# EAGLE schematic pdp8i-fpga (EAGLE 6.6.0), part 3 of 4
## Sheet 27 of 40
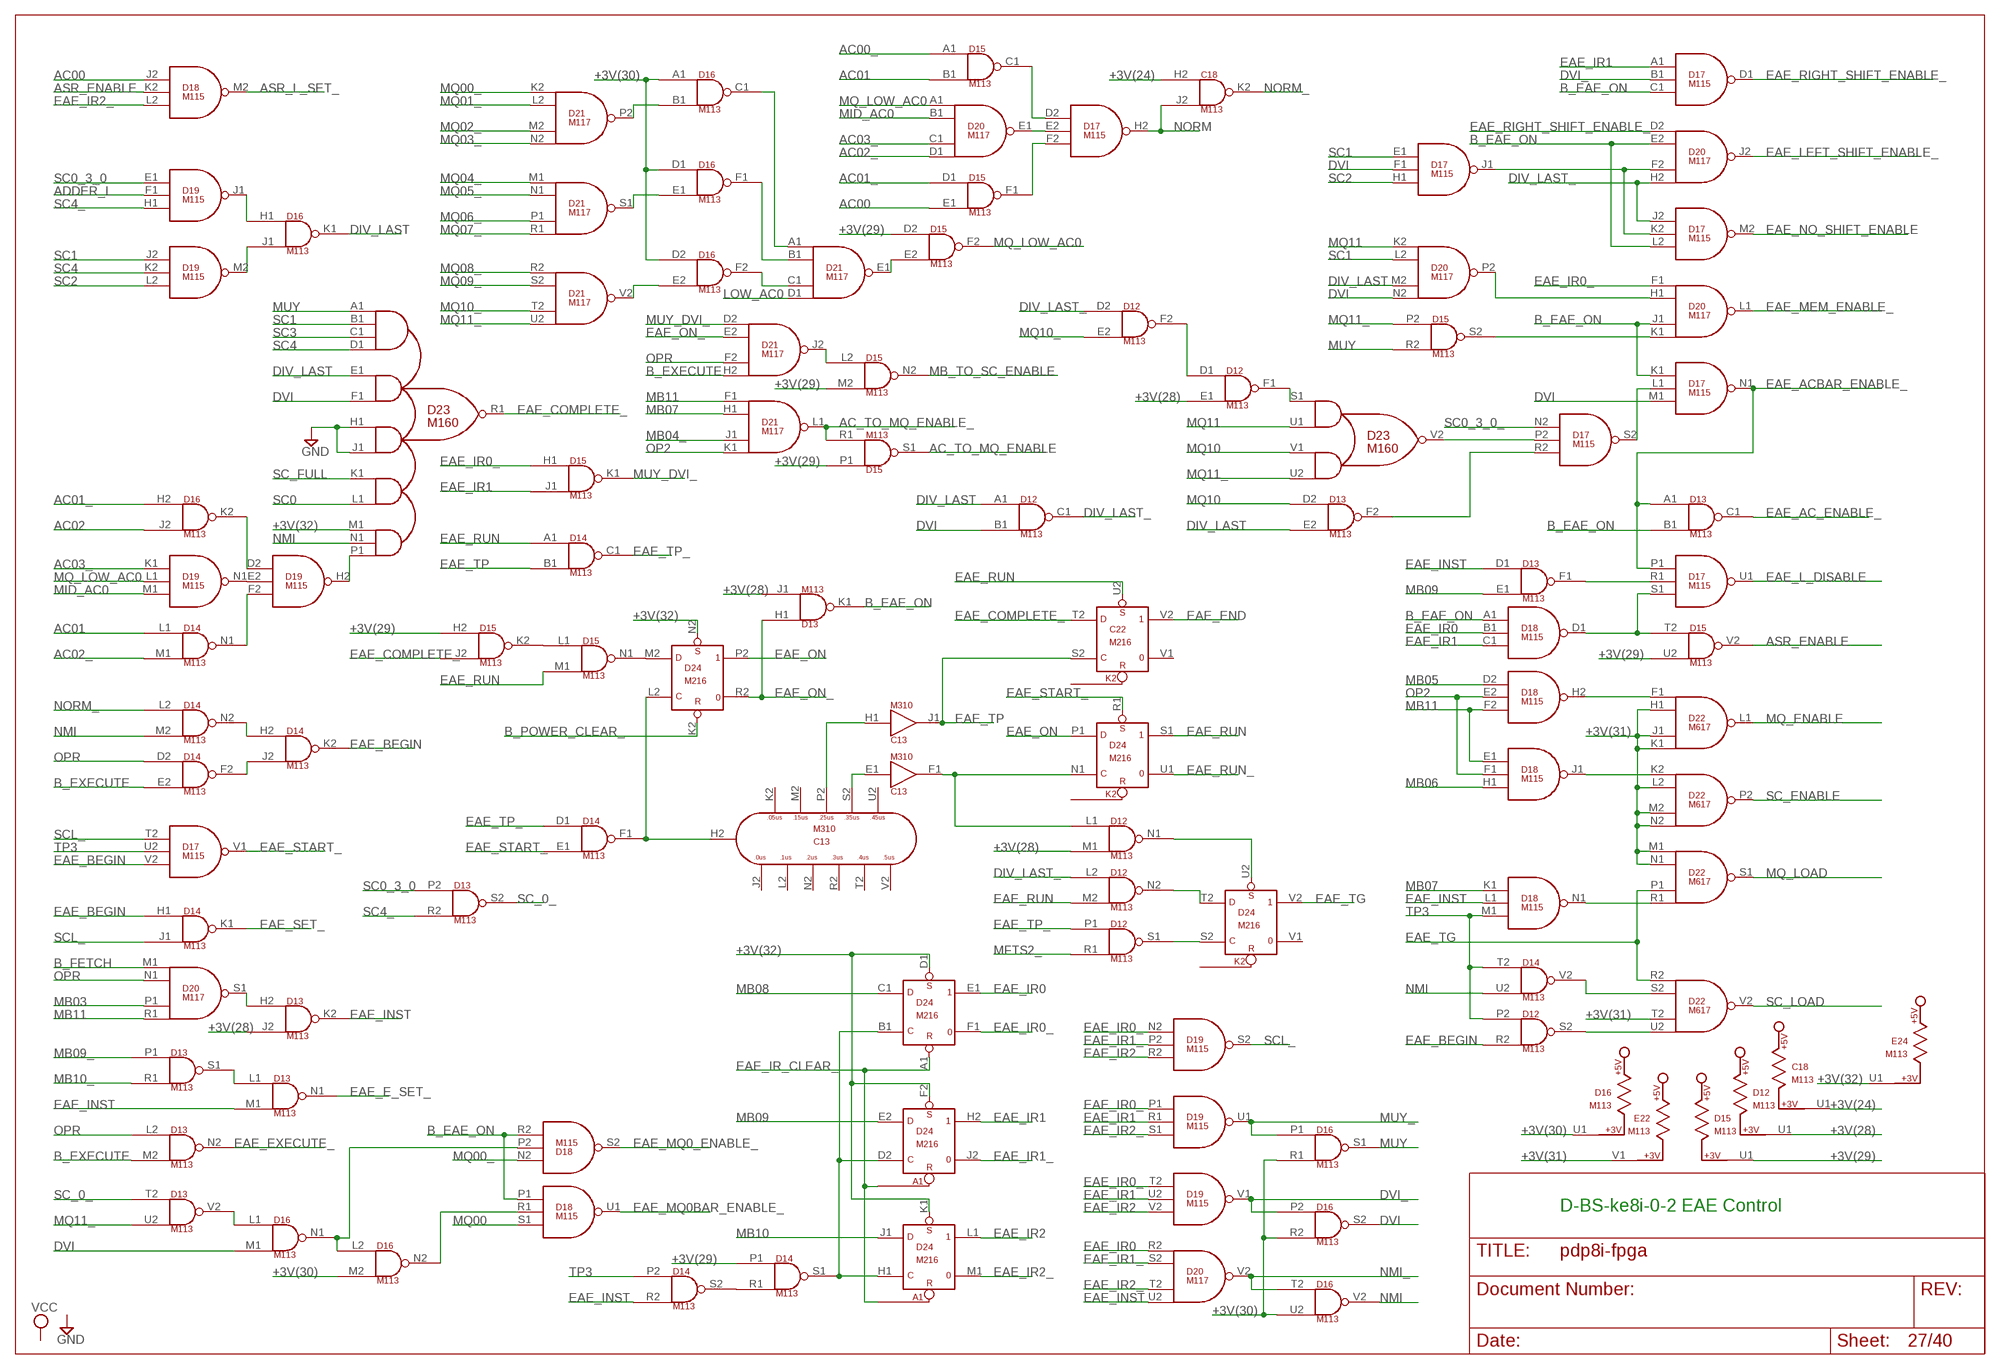
[diagram p27: schematic, sheet 27]

### Parts
C13  M310  [H807]
C18  M113  [H807]
C22  M216  [H807]
D12  M113  [H807]
D13  M113  [H807]
D14  M113  [H807]
D15  M113  [H807]
D16  M113  [H807]
D17  M115  [H807]
D18  M115  [H807]
D19  M115  [H807]
D20  M117  [H807]
D21  M117  [H807]
D22  M617  [H807]
D23  M160  [H807]
D24  M216  [H807]

### Nets
+3V(24): C18.H2(K2:IN1) C18.U1 ; also sheet 28
+3V(28): D12.E1(F1:IN2) D12.M1(N1:IN2) D12.U1 D13.J1(K1:IN2) D13.J2(K2:IN2) ; also sheet 28
+3V(29): D14.P1(S1:IN1) D15.D2(F2:IN1) D15.H2(K2:IN1) D15.M2(N2:IN2) D15.P1(S1:IN1) D15.U1 D15.U2(V2:IN2)
+3V(30): D16.A1(C1:IN1) D16.D1(F1:IN1) D16.D2(F2:IN1) D16.M2(N2:IN2) D16.R1(S1:IN2) D16.R2(S2:IN2) D16.U1 D16.U2(V2:IN2)
+3V(31): D22.H1(L1:IN2) D22.J1(L1:IN3) D22.K1(L1:IN4) D22.L2(P2:IN2) D22.M1(S1:IN1) D22.M2(P2:IN3) D22.N1(S1:IN2) D22.N2(P2:IN4) D22.T2(U2:IN3) E22.V1
+3V(32): D23.M1(R1:IN5A) D24.D1(E1:S) D24.F2(H2:S) D24.K1(L1:S) D24.N2(P2:S) E24.U1 ; also sheet 28
AC00: D15.E1(F1:IN2) D18.J2(M2:IN1) ; also sheet 7,9,14,28,37
AC00_: D15.A1(C1:IN1) ; also sheet 7,9
AC01: D14.L1(N1:IN1) D15.B1(C1:IN2) ; also sheet 9,14,28,37
AC01_: D15.D1(F1:IN1) D16.H2(K2:IN1) ; also sheet 7,9
AC02: D16.J2(K2:IN2) ; also sheet 9,14,28,33,37
AC02_: D14.M1(N1:IN2) D20.D1(E1:IN4) ; also sheet 7,9
AC03_: D19.K1(N1:IN1) D20.C1(E1:IN3) ; also sheet 7,9
AC_TO_MQ_ENABLE: D15.S1(S1:OUT) ; also sheet 28
AC_TO_MQ_ENABLE_: D15.R1(S1:IN2) D21.L1(L1:OUT) ; also sheet 5
ADDER_L: D19.F1(J1:IN2) ; also sheet 28
ASR_ENABLE: D15.V2(V2:OUT) D18.K2(M2:IN2) ; also sheet 9
ASR_L_SET_: D18.M2(M2:OUT) ; also sheet 9
B_EAE_ON: D13.B1(C1:IN2) D13.K1(K1:OUT) D17.C1(D1:IN3) D17.K1(N1:IN1) D17.L2(M2:IN3) D18.A1(D1:IN1) D18.P1(U1:IN1) D18.R2(S2:IN3) D20.E2(J2:IN2) D20.J1(L1:IN3) ; also sheet 9,28
B_EXECUTE: D13.M2(N2:IN2) D14.E2(F2:IN2) D21.H2(J2:IN4) ; also sheet 4,5,6,7
B_FETCH: D20.M1(S1:IN1) ; also sheet 2,4,5,6,7,8,22,29
B_POWER_CLEAR_: D24.K2(P2:R) ; also sheet 2,17
DIV_LAST: D12.A1(C1:IN1) D13.E2(F2:IN2) D16.K1(K1:OUT) D20.M2(P2:IN3) D23.E1(R1:IN2A)
DIV_LAST_: D12.C1(C1:OUT) D12.D2(F2:IN1) D12.L2(N2:IN1) D17.J2(M2:IN1) D20.H2(J2:IN4)
DVI: D12.B1(C1:IN2) D16.M1(N1:IN2) D16.S2(S2:OUT) D17.F1(J1:IN2) D17.M1(N1:IN3) D20.N2(P2:IN4) D23.F1(R1:IN2B)
DVI_: D16.P2(S2:IN1) D17.B1(D1:IN2) D19.V1(V1:OUT) ; also sheet 28
EAE_AC_ENABLE_: D13.C1(C1:OUT) ; also sheet 5
EAE_ACBAR_ENABLE_: D13.A1(C1:IN1) D17.N1(N1:OUT) D17.P1(U1:IN1) ; also sheet 5
EAE_BEGIN: D12.R2(S2:IN2) D14.H1(K1:IN1) D14.K2(K2:OUT) D17.V2(V1:IN3)
EAE_COMPLETE_: C22.T2(V2:D) D15.J2(K2:IN2) D23.R1(R1:OUT)
EAE_E_SET_: D13.N1(N1:OUT) ; also sheet 4,5
EAE_END: C22.V2 ; also sheet 2
EAE_EXECUTE_: D13.N2(N2:OUT) ; also sheet 6
EAE_INST: D13.D1(F1:IN1) D13.K2(K2:OUT) D13.M1(N1:IN2) D14.R2(S2:IN2) D18.L1(N1:IN2) D20.U2(V2:IN4)
EAE_IR0: D18.B1(D1:IN2) D20.R2(V2:IN1) D24.E1
EAE_IR0_: D15.H1(K1:IN1) D19.N2(S2:IN1) D19.P1(U1:IN1) D19.T2(V1:IN1) D20.F1(L1:IN1) D24.F1
EAE_IR1: D15.J1(K1:IN2) D17.A1(D1:IN1) D18.C1(D1:IN3) D19.R1(U1:IN2) D19.U2(V1:IN2) D24.H2
EAE_IR1_: D19.P2(S2:IN2) D20.S2(V2:IN2) D24.J2
EAE_IR2: D19.R2(S2:IN3) D19.V2(V1:IN3) D24.L1
EAE_IR2_: D18.L2(M2:IN3) D19.S1(U1:IN3) D20.T2(V2:IN3) D24.M1 ; also sheet 9
EAE_IR_CLEAR_: D24.A1(E1:R) ; also sheet 4
EAE_L_DISABLE: D17.U1(U1:OUT) ; also sheet 5
EAE_LEFT_SHIFT_ENABLE_: D20.J2(J2:OUT) ; also sheet 6
EAE_MEM_ENABLE_: D20.L1(L1:OUT) ; also sheet 5
EAE_MQ0_ENABLE_: D18.S2(S2:OUT) ; also sheet 13
EAE_MQ0BAR_ENABLE_: D18.U1(U1:OUT) ; also sheet 13
EAE_NO_SHIFT_ENABLE: D17.M2(M2:OUT) ; also sheet 6
EAE_ON: D24.P1(S1:D) D24.P2 ; also sheet 28
EAE_ON_: D13.H1(K1:IN1) D21.E2(J2:IN2) D24.R2 ; also sheet 9,13
EAE_RIGHT_SHIFT_ENABLE_: D17.D1(D1:OUT) D20.D2(J2:IN1) ; also sheet 6,28
EAE_RUN: C22.U2(V2:S) D12.M2(N2:IN2) D14.A1(C1:IN1) D15.M1(N1:IN2) D24.S1
EAE_RUN_: D24.U1
EAE_SET_: D14.K1(K1:OUT) ; also sheet 2
EAE_START_: D14.E1(F1:IN2) D17.V1(V1:OUT) D24.R1(S1:S) ; also sheet 2
EAE_TG: D22.P1(S1:IN3) D22.R2(U2:IN1) D24.V2
EAE_TP: C13.J1(J1:OUT) C22.S2(V2:C) D14.B1(C1:IN2)
EAE_TP_: D12.P1(S1:IN1) D14.C1(C1:OUT) D14.D1(F1:IN1) ; also sheet 7,28
GND [Suppply]: D23.H1(R1:IN3A) D23.J1(R1:IN3B) ; also sheet 2,5,9,10,11,12,13,14,15,22,26,30,33,34,35,39
LOW_AC0: D21.D1(E1:IN4) ; also sheet 7
MB03: D20.P1(S1:IN3) ; also sheet 4,5,9,14,21,29,30,34,38
MB04_: D21.J1(L1:IN3) ; also sheet 5,8,9,14,15,16,29,30,32,33,34,35,36,37
MB05: D18.D2(H2:IN1) ; also sheet 5,7,9,14,21,30,32,34,37
MB06: D18.H1(J1:IN3) ; also sheet 5,7,9,14,16,21,22,30,33,38
MB07: D18.K1(N1:IN1) D21.H1(L1:IN2) ; also sheet 5,7,9,14,15,21,22,26,30,33,34,35,37,38
MB08: D24.C1(E1:D) ; also sheet 6,7,9,14,15,21,22,26,30,33,34,36,37,38
MB09: D13.E1(F1:IN2) D24.E2(H2:D) ; also sheet 2,5,6,9,14,21,22,29,30,37
MB09_: D13.P1(S1:IN1) ; also sheet 6,9,26,28,30,33,37
MB10: D24.J1(L1:D) ; also sheet 2,6,8,9,14,21,22,29,30,33,37
MB10_: D13.R1(S1:IN2) ; also sheet 6,8,9,22,26,28,30,37
MB11: D18.E1(J1:IN1) D18.F2(H2:IN3) D20.R1(S1:IN4) D21.F1(L1:IN1) ; also sheet 2,6,9,14,21,22,29,30,33,37
MB_TO_SC_ENABLE: D15.N2(N2:OUT) ; also sheet 28
MFTS2_: D12.R1(S1:IN2) ; also sheet 2
MID_AC0: D19.M1(N1:IN3) D20.B1(E1:IN2) ; also sheet 7
MQ00: D18.S1(U1:IN3) ; also sheet 10,28
MQ00_: D18.N2(S2:IN1) D21.K2(P2:IN1) ; also sheet 28
MQ01_: D21.L2(P2:IN2) ; also sheet 28
MQ02_: D21.M2(P2:IN3) ; also sheet 28
MQ03_: D21.N2(P2:IN4) ; also sheet 28
MQ04_: D21.M1(S1:IN1) ; also sheet 28
MQ05_: D21.N1(S1:IN2) ; also sheet 28
MQ06_: D21.P1(S1:IN3) ; also sheet 28
MQ07_: D21.R1(S1:IN4) ; also sheet 28
MQ08_: D21.R2(V2:IN1) ; also sheet 28
MQ09_: D21.S2(V2:IN2) ; also sheet 28
MQ10: D13.D2(F2:IN1) D23.V1(V2:IN2A) ; also sheet 13,28
MQ10_: D12.E2(F2:IN2) D21.T2(V2:IN3) ; also sheet 28
MQ11: D20.K2(P2:IN1) D23.U1(V2:IN1B) ; also sheet 13,28
MQ11_: D13.U2(V2:IN2) D15.P2(S2:IN1) D21.U2(V2:IN4) D23.U2(V2:IN2B) ; also sheet 28
MQ_ENABLE: D22.L1(L1:OUT) ; also sheet 10,11,12,13
MQ_LOAD: D22.S1(S1:OUT) ; also sheet 28
MQ_LOW_AC0: D15.F2(F2:OUT) D19.L1(N1:IN2) D20.A1(E1:IN1)
MUY: D15.R2(S2:IN2) D16.S1(S1:OUT) D23.A1(R1:IN1A)
MUY_: D16.P1(S1:IN1) D19.U1(U1:OUT)
MUY_DVI_: D15.K1(K1:OUT) D21.D2(J2:IN1)
N$404: D16.H1(K1:IN1) D19.J1(J1:OUT)
N$405: D16.J1(K1:IN2) D19.M2(M2:OUT)
N$406: D19.E2(H2:IN2) D19.N1(N1:OUT)
N$419: D16.K2(K2:OUT) D19.D2(H2:IN1)
N$568: D14.N1(N1:OUT) D19.F2(H2:IN3)
N$570: D19.H2(H2:OUT) D23.P1(R1:IN5C)
N$571: D16.B1(C1:IN2) D21.P2(P2:OUT)
N$572: D16.E1(F1:IN2) D21.S1(S1:OUT)
N$573: D16.E2(F2:IN2) D21.V2(V2:OUT)
N$574: D16.C1(C1:OUT) D21.A1(E1:IN1)
N$575: D16.F2(F2:OUT) D21.C1(E1:IN3)
N$576: D16.F1(F1:OUT) D21.B1(E1:IN2)
N$577: D15.E2(F2:IN2) D21.E1(E1:OUT)
N$578: D17.E2(H2:IN2) D20.E1(E1:OUT)
N$579: D15.C1(C1:OUT) D17.D2(H2:IN1)
N$580: D15.F1(F1:OUT) D17.F2(H2:IN3)
N$581: D15.L2(N2:IN1) D21.J2(J2:OUT)
N$582: D17.J1(J1:OUT) D17.K2(M2:IN2) D20.F2(J2:IN3)
N$583: D17.L1(N1:IN2) D17.S2(S2:OUT)
N$584: D15.S2(S2:OUT) D20.K1(L1:IN4)
N$585: D17.P2(S2:IN2) D23.V2(V2:OUT)
N$586: D20.H1(L1:IN2) D20.P2(P2:OUT)
N$587: D12.D1(F1:IN1) D12.F2(F2:OUT)
N$588: D13.F2(F2:OUT) D17.R2(S2:IN3)
N$589: D12.F1(F1:OUT) D23.S1(V2:IN1A)
N$590: D15.K2(K2:OUT) D15.L1(N1:IN1)
N$591: D13.F1(F1:OUT) D17.R1(U1:IN2)
N$592: D15.T2(V2:IN1) D17.S1(U1:IN3) D18.D1(D1:OUT)
N$593: D18.H2(H2:OUT) D22.F1(L1:IN1)
N$594: D18.N1(N1:OUT) D22.R1(S1:IN4)
N$595: D12.S2(S2:OUT) D22.U2(U2:IN4)
N$596: C13.E1(F1:IN) C13.S2(H2:S2)
N$597: C13.H1(J1:IN) C13.P2(H2:P2)
N$598: D18.J1(J1:OUT) D22.K2(P2:IN1)
N$599: D14.V2(V2:OUT) D22.S2(U2:IN2)
N$600: D14.S1(S1:OUT) D24.B1(E1:C) D24.D2(H2:C) D24.H1(L1:C)
N$601: D14.R1(S1:IN2) D14.S2(S2:OUT)
N$602: D14.F2(F2:OUT) D14.J2(K2:IN2)
N$603: D12.N2(N2:OUT) D24.T2(V2:D)
N$604: D12.N1(N1:OUT) D24.U2(V2:S)
N$605: D12.S1(S1:OUT) D24.S2(V2:C)
N$606: D14.H2(K2:IN1) D14.N2(N2:OUT)
N$607: C13.H2(H2:H2) D14.F1(F1:OUT) D24.L2(P2:C)
N$608: C13.F1(F1:OUT) D12.L1(N1:IN1) D24.N1(S1:C)
N$609: D15.N1(N1:OUT) D24.M2(P2:D)
N$683: D13.H2(K2:IN1) D20.S1(S1:OUT)
N$684: D13.L1(N1:IN1) D13.S1(S1:OUT)
N$685: D13.V2(V2:OUT) D16.L1(N1:IN1)
N$686: D16.L2(N2:IN1) D16.N1(N1:OUT) D18.P2(S2:IN2)
N$688: D16.N2(N2:OUT) D18.R1(U1:IN2)
NMI: D14.M2(N2:IN2) D14.U2(V2:IN2) D16.V2(V2:OUT) D23.N1(R1:IN5B)
NMI_: D16.T2(V2:IN1) D20.V2(V2:OUT)
NORM: C18.J2(K2:IN2) D17.H2(H2:OUT)
NORM_: C18.K2(K2:OUT) D14.L2(N2:IN1)
OP2: D18.E2(H2:IN2) D18.F1(J1:IN2) D21.K1(L1:IN4) ; also sheet 2,5,7,26
OPR: D13.L2(N2:IN1) D14.D2(F2:IN1) D20.N1(S1:IN2) D21.F2(J2:IN3) ; also sheet 4,5,6,7
SC0: D23.L1(R1:IN4B) ; also sheet 12,28
SC0_3_0: D13.P2(S2:IN1) D19.E1(J1:IN1) ; also sheet 28
SC0_3_0_: D17.N2(S2:IN1) ; also sheet 28
SC1: D17.E1(J1:IN1) D19.J2(M2:IN1) D20.L2(P2:IN2) D23.B1(R1:IN1B) ; also sheet 12,28
SC2: D17.H1(J1:IN3) D19.L2(M2:IN3) ; also sheet 13,28
SC3: D23.C1(R1:IN1C) ; also sheet 13,28
SC4: D19.K2(M2:IN2) D23.D1(R1:IN1D) ; also sheet 13,28
SC4_: D13.R2(S2:IN2) D19.H1(J1:IN3) ; also sheet 28
SC_0_: D13.S2(S2:OUT) D13.T2(V2:IN1)
SC_ENABLE: D22.P2(P2:OUT) ; also sheet 10,11,12,13
SC_FULL: D23.K1(R1:IN4A) ; also sheet 28
SC_LOAD: D22.V2(U2:OUT) ; also sheet 28
SCL_: D14.J1(K1:IN2) D17.T2(V1:IN1) D19.S2(S2:OUT)
TP3: D12.P2(S2:IN1) D14.P2(S2:IN1) D14.T2(V2:IN1) D17.U2(V1:IN2) D18.M1(N1:IN3) ; also sheet 2,7,21,22,26,29,30
Unconnected: C13.J2(H2:J2) C13.K2(H2:K2) C13.L2(H2:L2) C13.M2(H2:M2) C13.N2(H2:N2) C13.R2(H2:R2) C13.T2(H2:T2) C13.U2(H2:U2) C13.V2(H2:V2) C18.V1 C22.V1 D12.V1 D13.U1 D13.V1 D14.U1 D14.V1 D15.V1 D16.V1 D18.T2(V1:IN1) D18.U2(V1:IN2) D18.V1(V1:OUT) D18.V2(V1:IN3) D20.U1 D20.V1 D21.U1 D21.V1 D24.V1

### Notes on the sheet
- D-BS-ke8i-0-2 EAE Control

## Sheet 28 of 40
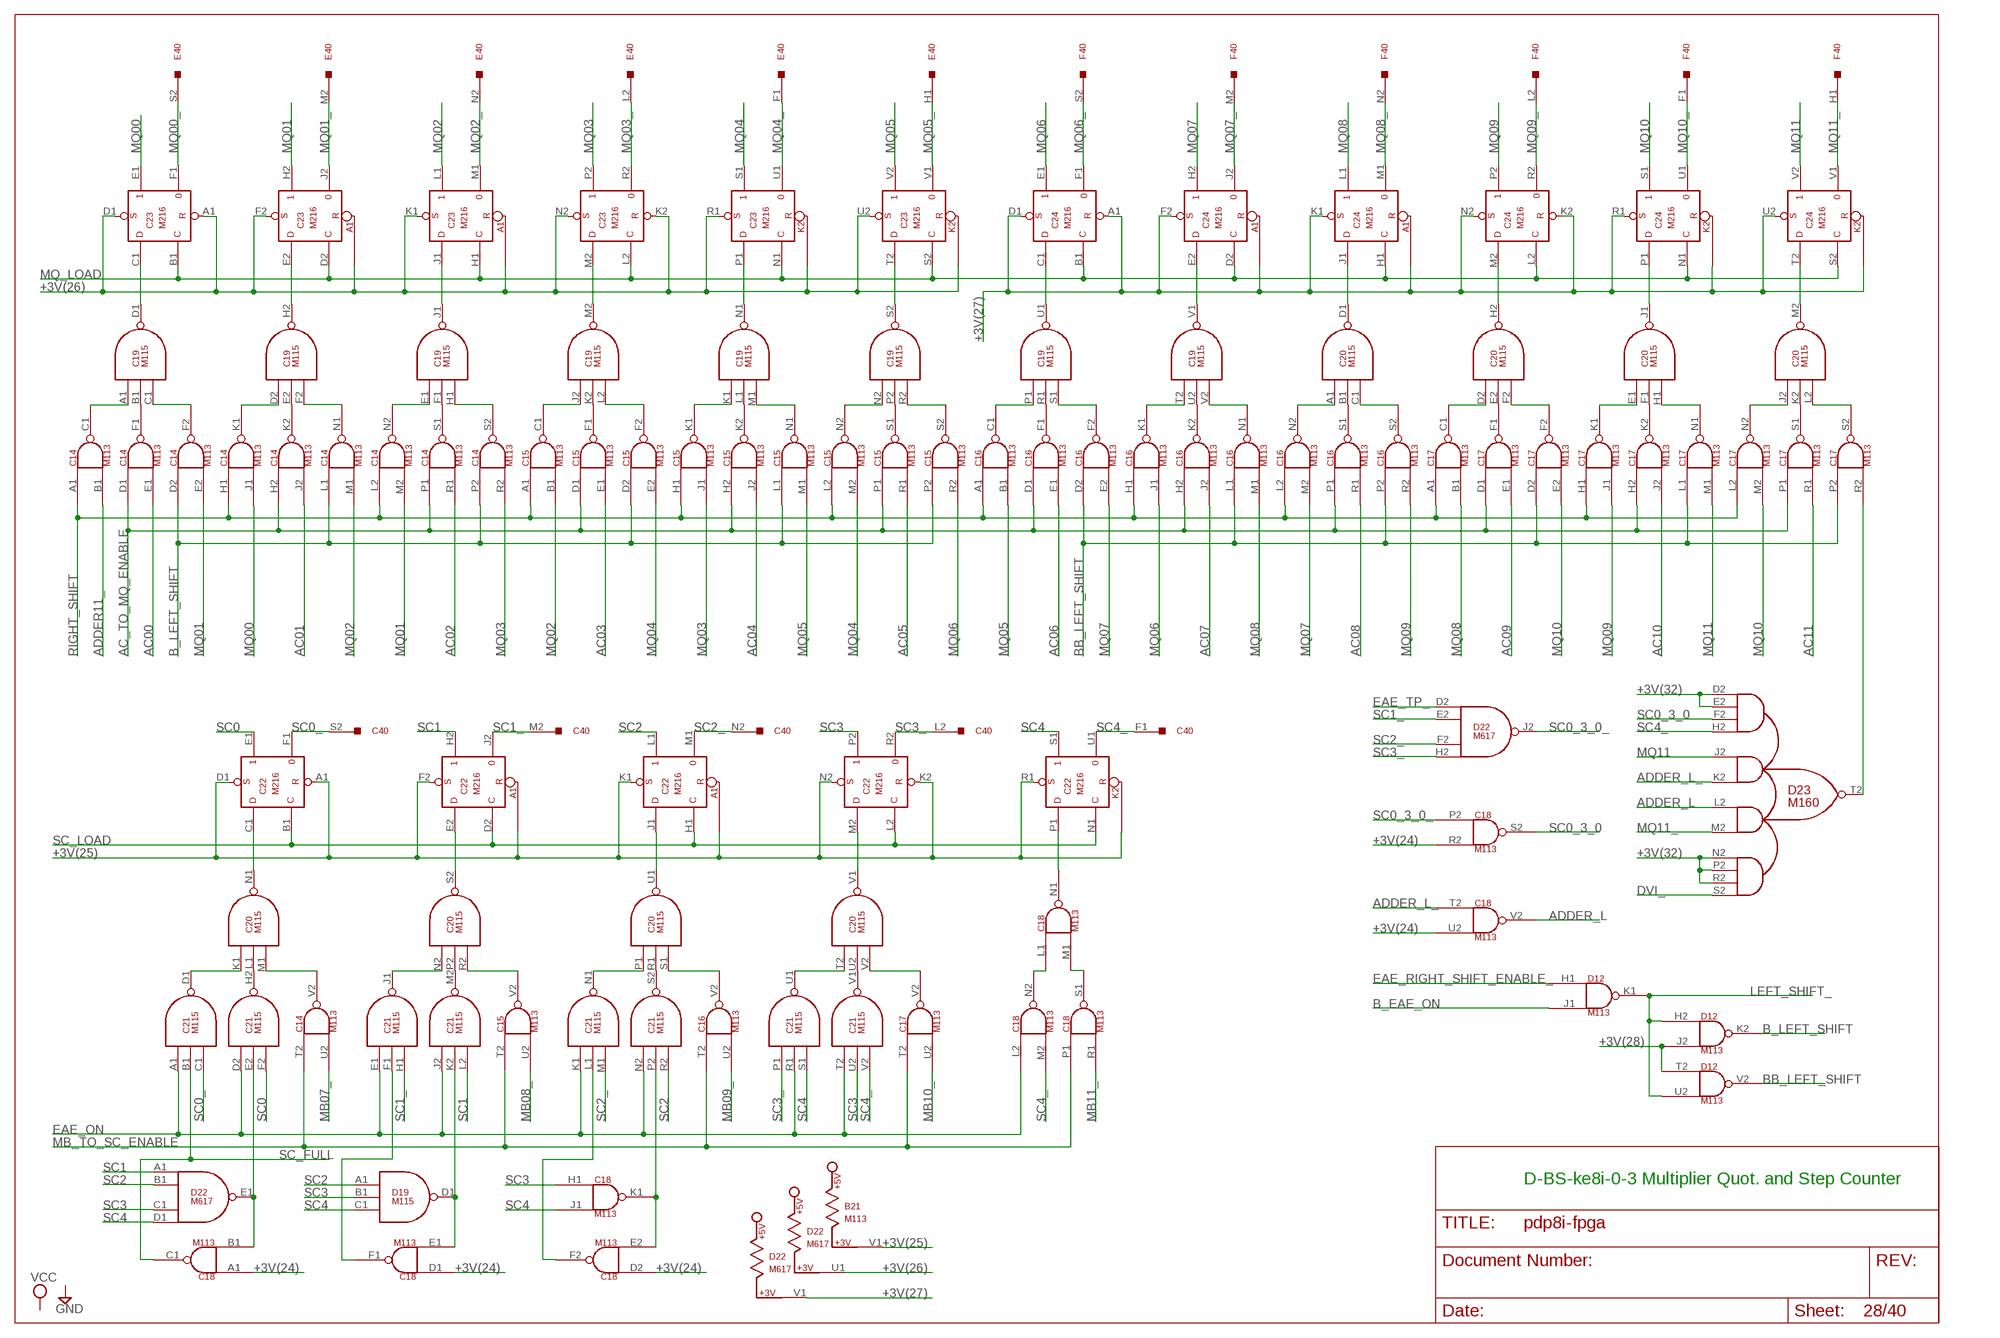
[diagram p28: schematic, sheet 28]

### Parts
C14  M113  [H807]
C15  M113  [H807]
C16  M113  [H807]
C17  M113  [H807]
C19  M115  [H807]
C20  M115  [H807]
C21  M115  [H807]
C23  M216  [H807]
C24  M216  [H807]

### Nets
+3V(24): C18.A1(C1:IN1) C18.D1(F1:IN1) C18.D2(F2:IN1) C18.R2(S2:IN2) C18.U2(V2:IN2) ; also sheet 27
+3V(25): B21.V1 C22.A1(E1:R) C22.D1(E1:S) C22.F2(H2:S) C22.K1(L1:S) C22.K2(P2:R) C22.N2(P2:S) C22.R1(S1:S)
+3V(26): C23.A1(E1:R) C23.D1(E1:S) C23.F2(H2:S) C23.K1(L1:S) C23.K2(P2:R) C23.N2(P2:S) C23.R1(S1:S) C23.U2(V2:S) D22.U1
+3V(27): C24.A1(E1:R) C24.D1(E1:S) C24.F2(H2:S) C24.K1(L1:S) C24.K2(P2:R) C24.N2(P2:S) C24.R1(S1:S) C24.U2(V2:S) D22.V1
+3V(28): D12.J2(K2:IN2) D12.T2(V2:IN1) ; also sheet 27
+3V(32): D23.D2(T2:IN1A) D23.E2(T2:IN1B) D23.N2(T2:IN4A) D23.P2(T2:IN4B) D23.R2(T2:IN4C) ; also sheet 27
AC00: C14.E1(F1:IN2) ; also sheet 7,9,14,27,37
AC01: C14.J2(K2:IN2) ; also sheet 9,14,27,37
AC02: C14.R1(S1:IN2) ; also sheet 9,14,27,33,37
AC03: C15.E1(F1:IN2) ; also sheet 9,14,33,37
AC04: C15.J2(K2:IN2) ; also sheet 9,14,16,33,35,37
AC05: C15.R1(S1:IN2) ; also sheet 9,14,16,33,35,37
AC06: C16.E1(F1:IN2) ; also sheet 9,14,16,33,35,37
AC07: C16.J2(K2:IN2) ; also sheet 9,14,16,33,35,37
AC08: C16.R1(S1:IN2) ; also sheet 9,14,16,33,35,37
AC09: C17.E1(F1:IN2) ; also sheet 9,14,16,33,35,37
AC10: C17.J2(K2:IN2) ; also sheet 9,14,16,33,35,37
AC11: C17.R1(S1:IN2) ; also sheet 9,14,16,33,35,37
AC_TO_MQ_ENABLE: C14.D1(F1:IN1) C14.H2(K2:IN1) C14.P1(S1:IN1) C15.D1(F1:IN1) C15.H2(K2:IN1) C15.P1(S1:IN1) C16.D1(F1:IN1) C16.H2(K2:IN1) C16.P1(S1:IN1) C17.D1(F1:IN1) C17.H2(K2:IN1) C17.P1(S1:IN1) ; also sheet 27
ADDER11_: C14.B1(C1:IN2) ; also sheet 9
ADDER_L: C18.V2(V2:OUT) D23.L2(T2:IN3A) ; also sheet 27
ADDER_L_: C18.T2(V2:IN1) D23.K2(T2:IN2B) ; also sheet 9,10,13
B_EAE_ON: D12.J1(K1:IN2) ; also sheet 9,27
B_LEFT_SHIFT: C14.D2(F2:IN1) C14.L1(N1:IN1) C14.P2(S2:IN1) C15.D2(F2:IN1) C15.L1(N1:IN1) C15.P2(S2:IN1) D12.K2(K2:OUT)
BB_LEFT_SHIFT: C16.D2(F2:IN1) C16.L1(N1:IN1) C16.P2(S2:IN1) C17.D2(F2:IN1) C17.L1(N1:IN1) C17.P2(S2:IN1) D12.V2(V2:OUT)
DVI_: D23.S2(T2:IN4D) ; also sheet 27
EAE_ON: C18.L2(N2:IN1) C21.A1(D1:IN1) C21.D2(H2:IN1) C21.E1(J1:IN1) C21.J2(M2:IN1) C21.K1(N1:IN1) C21.N2(S2:IN1) C21.R1(U1:IN2) C21.T2(V1:IN1) ; also sheet 27
EAE_RIGHT_SHIFT_ENABLE_: D12.H1(K1:IN1) ; also sheet 6,27
EAE_TP_: D22.D2(J2:IN1) ; also sheet 7,27
LEFT_SHIFT_: D12.H2(K2:IN1) D12.K1(K1:OUT) D12.U2(V2:IN2)
MB07_: C14.U2(V2:IN2) ; also sheet 5,8,9,14,16,22,26,29,30,32,33,34,36
MB08_: C15.U2(V2:IN2) ; also sheet 6,7,8,9,14,16,22,26,29,30,32,33,34,35
MB09_: C16.U2(V2:IN2) ; also sheet 6,9,26,27,30,33,37
MB10_: C17.U2(V2:IN2) ; also sheet 6,8,9,22,26,27,30,37
MB11_: C18.R1(S1:IN2) ; also sheet 2,5,7,8,9,22,26,29,30
MB_TO_SC_ENABLE: C14.T2(V2:IN1) C15.T2(V2:IN1) C16.T2(V2:IN1) C17.T2(V2:IN1) C18.P1(S1:IN1) ; also sheet 27
MQ00: C14.J1(K1:IN2) C23.E1 ; also sheet 10,27
MQ00_: C23.F1 E40.S2 ; also sheet 27
MQ01: C14.E2(F2:IN2) C14.M2(N2:IN2) C23.H2 ; also sheet 10
MQ01_: C23.J2 E40.M2 ; also sheet 27
MQ02: C14.M1(N1:IN2) C15.B1(C1:IN2) C23.L1 ; also sheet 10
MQ02_: C23.M1 E40.N2 ; also sheet 27
MQ03: C14.R2(S2:IN2) C15.J1(K1:IN2) C23.P2 ; also sheet 11
MQ03_: C23.R2 E40.L2 ; also sheet 27
MQ04: C15.E2(F2:IN2) C15.M2(N2:IN2) C23.S1 ; also sheet 11
MQ04_: C23.U1 E40.F1 ; also sheet 27
MQ05: C15.M1(N1:IN2) C16.B1(C1:IN2) C23.V2 ; also sheet 11
MQ05_: C23.V1 E40.H1 ; also sheet 27
MQ06: C15.R2(S2:IN2) C16.J1(K1:IN2) C24.E1 ; also sheet 12
MQ06_: C24.F1 F40.S2 ; also sheet 27
MQ07: C16.E2(F2:IN2) C16.M2(N2:IN2) C24.H2 ; also sheet 12
MQ07_: C24.J2 F40.M2 ; also sheet 27
MQ08: C16.M1(N1:IN2) C17.B1(C1:IN2) C24.L1 ; also sheet 12
MQ08_: C24.M1 F40.N2 ; also sheet 27
MQ09: C16.R2(S2:IN2) C17.J1(K1:IN2) C24.P2 ; also sheet 13
MQ09_: C24.R2 F40.L2 ; also sheet 27
MQ10: C17.E2(F2:IN2) C17.M2(N2:IN2) C24.S1 ; also sheet 13,27
MQ10_: C24.U1 F40.F1 ; also sheet 27
MQ11: C17.M1(N1:IN2) C24.V2 D23.J2(T2:IN2A) ; also sheet 13,27
MQ11_: C24.V1 D23.M2(T2:IN3B) F40.H1 ; also sheet 27
MQ_LOAD: C23.B1(E1:C) C23.D2(H2:C) C23.H1(L1:C) C23.L2(P2:C) C23.N1(S1:C) C23.S2(V2:C) C24.B1(E1:C) C24.D2(H2:C) C24.H1(L1:C) C24.L2(P2:C) C24.N1(S1:C) C24.S2(V2:C) ; also sheet 27
N$610: C14.F1(F1:OUT) C19.B1(D1:IN2)
N$611: C14.K2(K2:OUT) C19.E2(H2:IN2)
N$612: C14.S1(S1:OUT) C19.F1(J1:IN2)
N$613: C15.F1(F1:OUT) C19.K2(M2:IN2)
N$614: C15.K2(K2:OUT) C19.L1(N1:IN2)
N$615: C15.S1(S1:OUT) C19.P2(S2:IN2)
N$616: C16.F1(F1:OUT) C19.R1(U1:IN2)
N$617: C16.K2(K2:OUT) C19.U2(V1:IN2)
N$618: C16.S1(S1:OUT) C20.B1(D1:IN2)
N$619: C17.F1(F1:OUT) C20.E2(H2:IN2)
N$620: C17.K2(K2:OUT) C20.F1(J1:IN2)
N$621: C17.S1(S1:OUT) C20.K2(M2:IN2)
N$622: C14.C1(C1:OUT) C19.A1(D1:IN1)
N$623: C14.F2(F2:OUT) C19.C1(D1:IN3)
N$624: C14.K1(K1:OUT) C19.D2(H2:IN1)
N$625: C14.N1(N1:OUT) C19.F2(H2:IN3)
N$626: C14.N2(N2:OUT) C19.E1(J1:IN1)
N$627: C14.S2(S2:OUT) C19.H1(J1:IN3)
N$628: C15.C1(C1:OUT) C19.J2(M2:IN1)
N$629: C15.F2(F2:OUT) C19.L2(M2:IN3)
N$630: C15.K1(K1:OUT) C19.K1(N1:IN1)
N$631: C15.N1(N1:OUT) C19.M1(N1:IN3)
N$632: C15.N2(N2:OUT) C19.N2(S2:IN1)
N$633: C15.S2(S2:OUT) C19.R2(S2:IN3)
N$634: C16.C1(C1:OUT) C19.P1(U1:IN1)
N$635: C16.F2(F2:OUT) C19.S1(U1:IN3)
N$636: C16.K1(K1:OUT) C19.T2(V1:IN1)
N$637: C16.N1(N1:OUT) C19.V2(V1:IN3)
N$638: C16.N2(N2:OUT) C20.A1(D1:IN1)
N$639: C16.S2(S2:OUT) C20.C1(D1:IN3)
N$640: C17.C1(C1:OUT) C20.D2(H2:IN1)
N$641: C17.F2(F2:OUT) C20.F2(H2:IN3)
N$642: C17.K1(K1:OUT) C20.E1(J1:IN1)
N$643: C17.N1(N1:OUT) C20.H1(J1:IN3)
N$644: C17.N2(N2:OUT) C20.J2(M2:IN1)
N$645: C17.S2(S2:OUT) C20.L2(M2:IN3)
N$646: C19.D1(D1:OUT) C23.C1(E1:D)
N$647: C19.H2(H2:OUT) C23.E2(H2:D)
N$648: C19.J1(J1:OUT) C23.J1(L1:D)
N$649: C19.M2(M2:OUT) C23.M2(P2:D)
N$650: C19.N1(N1:OUT) C23.P1(S1:D)
N$651: C19.S2(S2:OUT) C23.T2(V2:D)
N$652: C19.U1(U1:OUT) C24.C1(E1:D)
N$653: C19.V1(V1:OUT) C24.E2(H2:D)
N$654: C20.D1(D1:OUT) C24.J1(L1:D)
N$655: C20.H2(H2:OUT) C24.M2(P2:D)
N$656: C20.J1(J1:OUT) C24.P1(S1:D)
N$657: C20.M2(M2:OUT) C24.T2(V2:D)
N$658: C20.L1(N1:IN2) C21.H2(H2:OUT)
N$659: C20.K1(N1:IN1) C21.D1(D1:OUT)
N$660: C14.V2(V2:OUT) C20.M1(N1:IN3)
N$661: C20.N1(N1:OUT) C22.C1(E1:D)
N$662: C18.L1(N1:IN1) C18.N2(N2:OUT)
N$663: C18.M1(N1:IN2) C18.S1(S1:OUT)
N$664: C20.S2(S2:OUT) C22.E2(H2:D)
N$665: C20.U1(U1:OUT) C22.J1(L1:D)
N$666: C20.V1(V1:OUT) C22.M2(P2:D)
N$667: C18.N1(N1:OUT) C22.P1(S1:D)
N$668: C20.N2(S2:IN1) C21.J1(J1:OUT)
N$669: C20.P1(U1:IN1) C21.N1(N1:OUT)
N$670: C20.T2(V1:IN1) C21.U1(U1:OUT)
N$671: C20.P2(S2:IN2) C21.M2(M2:OUT)
N$672: C20.R1(U1:IN2) C21.S2(S2:OUT)
N$673: C20.U2(V1:IN2) C21.V1(V1:OUT)
N$674: C15.V2(V2:OUT) C20.R2(S2:IN3)
N$675: C16.V2(V2:OUT) C20.S1(U1:IN3)
N$676: C17.V2(V2:OUT) C20.V2(V1:IN3)
N$677: C18.B1(C1:IN2) C21.E2(H2:IN2) D22.E1(E1:OUT)
N$678: C18.E1(F1:IN2) C21.K2(M2:IN2) D19.D1(D1:OUT)
N$679: C18.F1(F1:OUT) C21.F1(J1:IN2)
N$680: C18.E2(F2:IN2) C18.K1(K1:OUT) C21.P2(S2:IN2)
N$681: C18.F2(F2:OUT) C21.L1(N1:IN2)
N$682: C17.R2(S2:IN2) D23.T2(T2:OUT)
RIGHT_SHIFT: C14.A1(C1:IN1) C14.H1(K1:IN1) C14.L2(N2:IN1) C15.A1(C1:IN1) C15.H1(K1:IN1) C15.L2(N2:IN1) C16.A1(C1:IN1) C16.H1(K1:IN1) C16.L2(N2:IN1) C17.A1(C1:IN1) C17.H1(K1:IN1) C17.L2(N2:IN1) ; also sheet 6,9,10,11,12,13
SC0: C21.F2(H2:IN3) C22.E1 ; also sheet 12,27
SC0_: C21.C1(D1:IN3) C22.F1 C40.S2
SC0_3_0: C18.S2(S2:OUT) D23.F2(T2:IN1C) ; also sheet 27
SC0_3_0_: C18.P2(S2:IN1) D22.J2(J2:OUT) ; also sheet 27
SC1: C21.L2(M2:IN3) C22.H2 D22.A1(E1:IN1) ; also sheet 12,27
SC1_: C21.H1(J1:IN3) C22.J2 C40.M2 D22.E2(J2:IN2)
SC2: C21.R2(S2:IN3) C22.L1 D19.A1(D1:IN1) D22.B1(E1:IN2) ; also sheet 13,27
SC2_: C21.M1(N1:IN3) C22.M1 C40.N2 D22.F2(J2:IN3)
SC3: C18.H1(K1:IN1) C21.U2(V1:IN2) C22.P2 D19.B1(D1:IN2) D22.C1(E1:IN3) ; also sheet 13,27
SC3_: C21.P1(U1:IN1) C22.R2 C40.L2 D22.H2(J2:IN4)
SC4: C18.J1(K1:IN2) C21.S1(U1:IN3) C22.S1 D19.C1(D1:IN3) D22.D1(E1:IN4) ; also sheet 13,27
SC4_: C18.M2(N2:IN2) C21.V2(V1:IN3) C22.U1 C40.F1 D23.H2(T2:IN1D) ; also sheet 27
SC_FULL: C18.C1(C1:OUT) C21.B1(D1:IN2) ; also sheet 27
SC_LOAD: C22.B1(E1:C) C22.D2(H2:C) C22.H1(L1:C) C22.L2(P2:C) C22.N1(S1:C) ; also sheet 27
Unconnected: C14.U1 C14.V1 C15.U1 C15.V1 C16.U1 C16.V1 C17.U1 C17.V1

### Notes on the sheet
- D-BS-ke8i-0-3 Multiplier Quot. and Step Counter

## Sheet 29 of 40
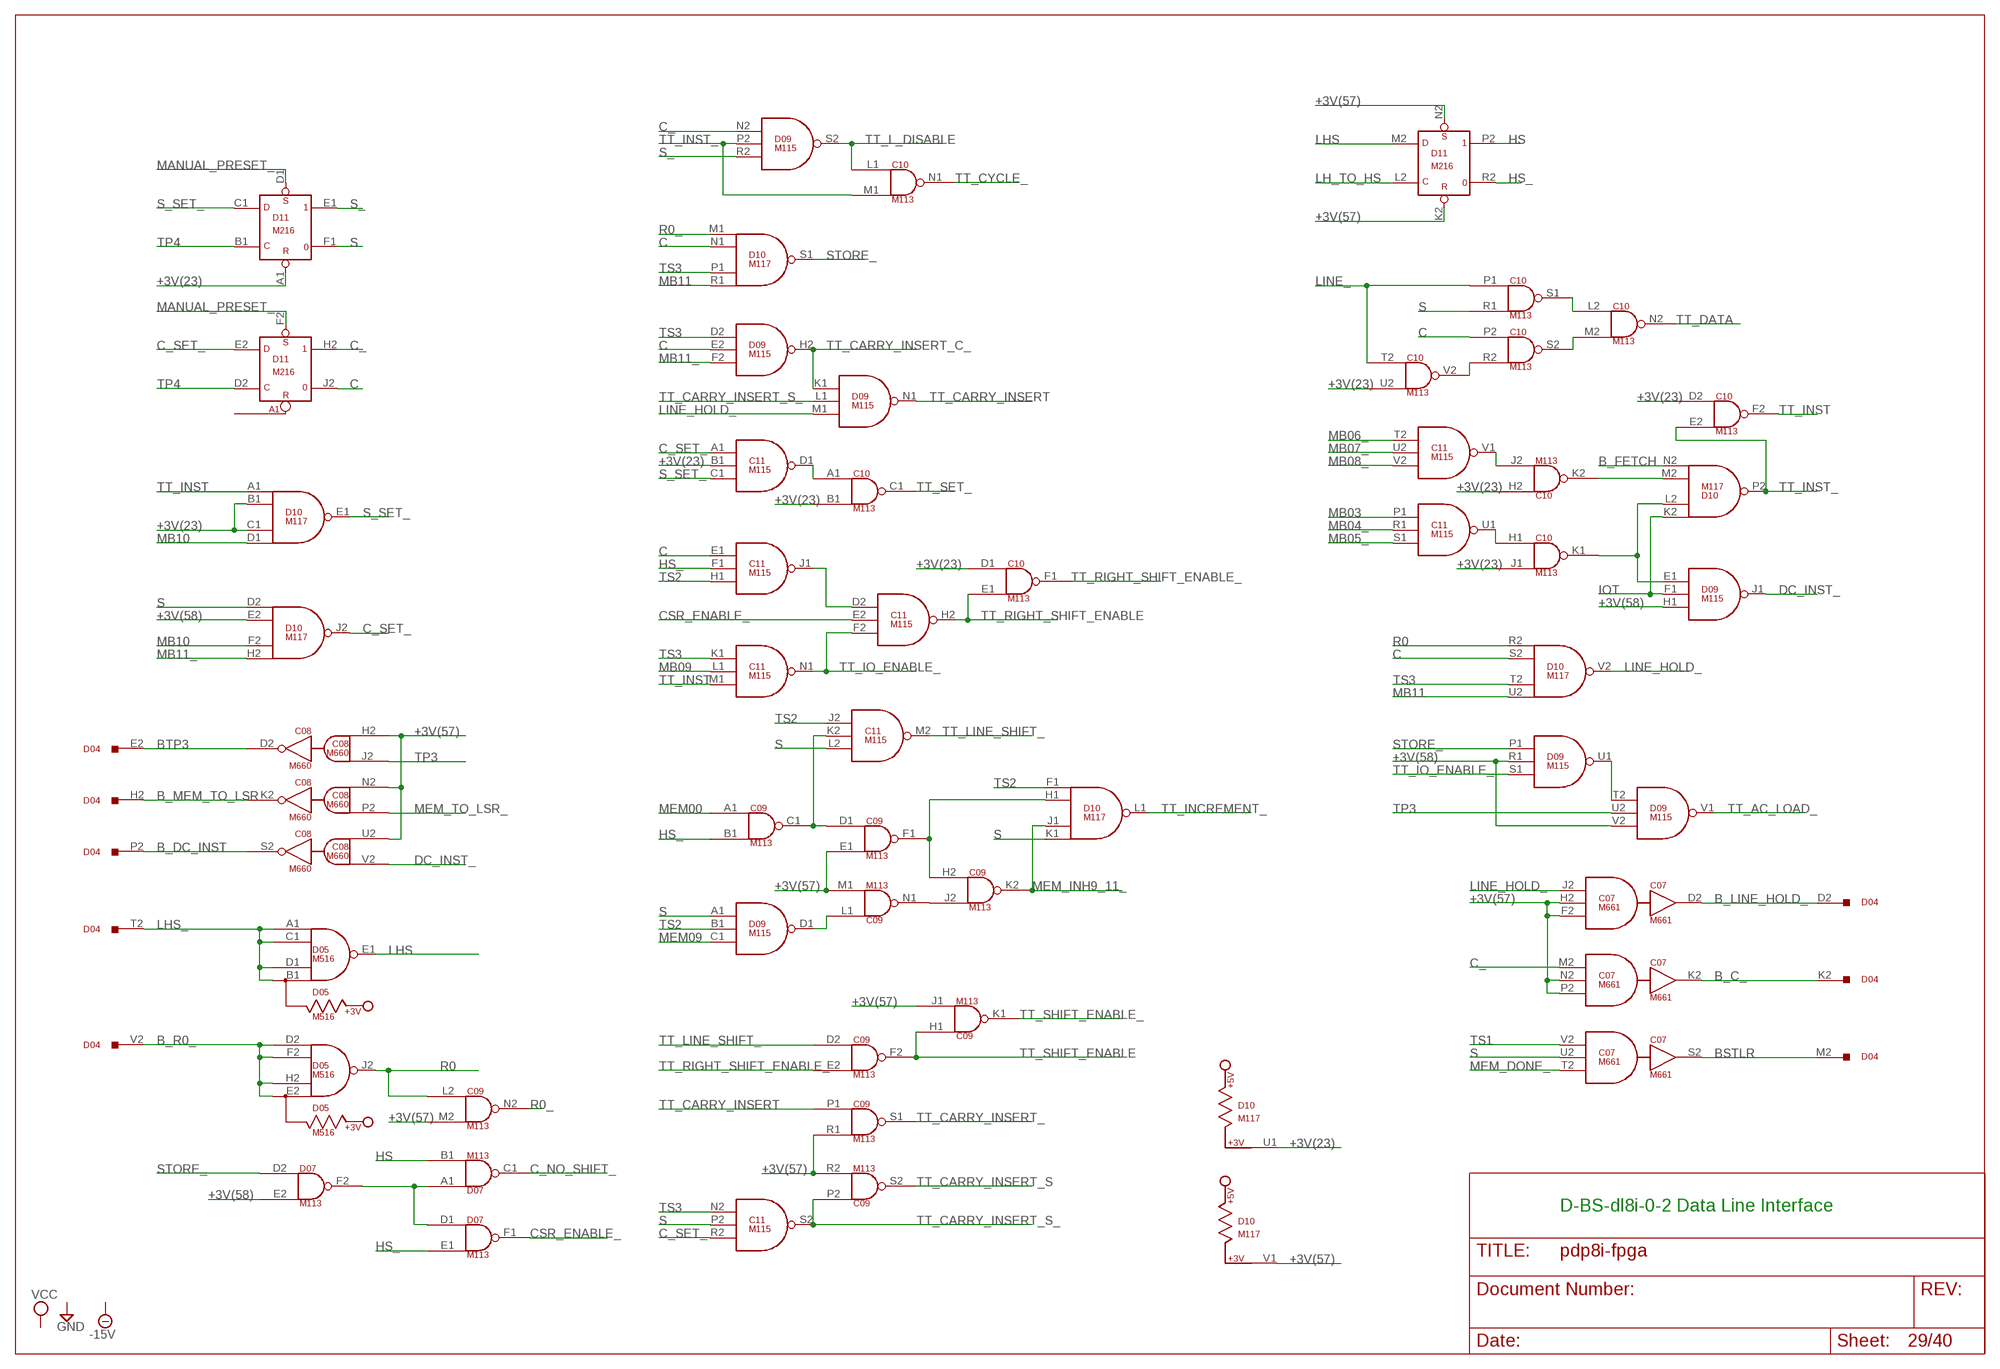
[diagram p29: schematic, sheet 29]

### Parts
C07  M661  [H807]
C08  M660  [H807]
C09  M113  [H807]
C10  M113  [H807]
C11  M115  [H807]
D04  W011  [H807]
D05  M516  [H807]
D09  M115  [H807]
D10  M117  [H807]
D11  M216  [H807]

### Nets
+3V(23): C10.B1(C1:IN2) C10.D1(F1:IN1) C10.D2(F2:IN1) C10.H2(K2:IN1) C10.J1(K1:IN2) C10.U2(V2:IN2) C11.B1(D1:IN2) D10.B1(E1:IN2) D10.C1(E1:IN3) D10.U1 D11.A1(E1:R)
+3V(57): C07.F2(D:IN3) C07.H2(D:IN2) C07.N2(K:IN2) C07.P2(K:IN3) C08.H2(D:IN1) C08.N2(K:IN1) C08.U2(S:IN1) C09.E1(F1:IN2) C09.J1(K1:IN2) C09.M1(N1:IN2) C09.M2(N2:IN2) C09.R1(S1:IN2) C09.R2(S2:IN2) D10.V1 D11.K2(P2:R) D11.N2(P2:S)
+3V(58): D07.E2(F2:IN2) D09.H1(J1:IN3) D09.R1(U1:IN2) D09.V2(V1:IN3) D10.E2(J2:IN2) ; also sheet 2,3
B_C_: C07.K2(K:OUT) D04.K2
B_DC_INST: C08.S2(S:OUT) D04.P2
B_FETCH: D10.N2(P2:IN4) ; also sheet 2,4,5,6,7,8,22,27
B_LINE_HOLD_: C07.D2(D:OUT) D04.D2
B_MEM_TO_LSR: C08.K2(K:OUT) D04.H2
B_R0_: D04.V2 D05.D2(J2:IN) D05.E2(J2:IN2) D05.F2(J2:IN3) D05.H2(J2:IN4)
BSTLR: C07.S2(S:OUT) D04.M2
BTP3: C08.D2(D:OUT) D04.E2
C: C10.P2(S2:IN1) C11.E1(J1:IN1) D09.E2(H2:IN2) D10.N1(S1:IN2) D10.S2(V2:IN2) D11.J2
C_: C07.M2(K:IN1) D09.N2(S2:IN1) D11.H2
C_NO_SHIFT_: D07.C1(C1:OUT) ; also sheet 6
C_SET_: C11.A1(D1:IN1) C11.R2(S2:IN3) D10.J2(J2:OUT) D11.E2(H2:D)
CSR_ENABLE_: C11.E2(H2:IN2) D07.F1(F1:OUT)
DC_INST_: C08.V2(S:IN2) D09.J1(J1:OUT)
HS: D07.B1(C1:IN2) D11.P2
HS_: C09.B1(C1:IN2) C11.F1(J1:IN2) D07.E1(F1:IN2) D11.R2
IOT: D09.F1(J1:IN2) D10.K2(P2:IN1) ; also sheet 2,4,7,8,22
LH_TO_HS: D11.L2(P2:C) ; also sheet 3
LHS: D05.E1(E1:OUT) D11.M2(P2:D)
LHS_: D04.T2 D05.A1(E1:IN) D05.B1(E1:IN2) D05.C1(E1:IN3) D05.D1(E1:IN4)
LINE_: C10.P1(S1:IN1) C10.T2(V2:IN1) ; also sheet 14
LINE_HOLD_: C07.J2(D:IN1) D09.M1(N1:IN3) D10.V2(V2:OUT)
MANUAL_PRESET_: D11.D1(E1:S) D11.F2(H2:S) ; also sheet 2,4,8,21
MB03: C11.P1(U1:IN1) ; also sheet 4,5,9,14,21,27,30,34,38
MB04_: C11.R1(U1:IN2) ; also sheet 5,8,9,14,15,16,27,30,32,33,34,35,36,37
MB05_: C11.S1(U1:IN3) ; also sheet 5,8,9,14,15,16,22,30,33,35,36,38
MB06_: C11.T2(V1:IN1) ; also sheet 5,8,9,14,15,22,30,32,34,35,36,37,38
MB07_: C11.U2(V1:IN2) ; also sheet 5,8,9,14,16,22,26,28,30,32,33,34,36
MB08_: C11.V2(V1:IN3) ; also sheet 6,7,8,9,14,16,22,26,28,30,32,33,34,35
MB09: C11.L1(N1:IN2) ; also sheet 2,5,6,9,14,21,22,27,30,37
MB10: D10.D1(E1:IN4) D10.F2(J2:IN3) ; also sheet 2,6,8,9,14,21,22,27,30,33,37
MB11: D10.R1(S1:IN4) D10.U2(V2:IN4) ; also sheet 2,6,9,14,21,22,27,30,33,37
MB11_: D09.F2(H2:IN3) D10.H2(J2:IN4) ; also sheet 2,5,7,8,9,22,26,28,30
MEM00: C09.A1(C1:IN1) ; also sheet 4,10,18,31
MEM09: D09.C1(D1:IN3) ; also sheet 13,18,31
MEM_DONE_: C07.T2(S:IN3) ; also sheet 2,8,21
MEM_INH9_11_: C09.K2(K2:OUT) D10.J1(L1:IN3) ; also sheet 5
MEM_TO_LSR_: C08.P2(K:IN2) ; also sheet 3
N$725: D07.A1(C1:IN1) D07.D1(F1:IN1) D07.F2(F2:OUT)
N$726: C09.L1(N1:IN1) D09.D1(D1:OUT)
N$727: C09.J2(K2:IN2) C09.N1(N1:OUT)
N$728: C09.C1(C1:OUT) C09.D1(F1:IN1) C11.K2(M2:IN2)
N$729: C09.F1(F1:OUT) C09.H2(K2:IN1) D10.H1(L1:IN2)
N$730: C11.D2(H2:IN1) C11.J1(J1:OUT)
N$731: C10.A1(C1:IN1) C11.D1(D1:OUT)
N$732: D09.T2(V1:IN1) D09.U1(U1:OUT)
N$733: C10.K1(K1:OUT) D09.E1(J1:IN1) D10.L2(P2:IN2)
N$742: C10.H1(K1:IN1) C11.U1(U1:OUT)
N$743: C10.J2(K2:IN2) C11.V1(V1:OUT)
N$744: C10.K2(K2:OUT) D10.M2(P2:IN3)
N$745: C10.R2(S2:IN2) C10.V2(V2:OUT)
N$746: C10.L2(N2:IN1) C10.S1(S1:OUT)
N$747: C10.M2(N2:IN2) C10.S2(S2:OUT)
R0: C09.L2(N2:IN1) D05.J2(J2:OUT) D10.R2(V2:IN1)
R0_: C09.N2(N2:OUT) D10.M1(S1:IN1)
S: C07.U2(S:IN2) C10.R1(S1:IN2) C11.L2(M2:IN3) C11.P2(S2:IN2) D09.A1(D1:IN1) D10.D2(J2:IN1) D10.K1(L1:IN4) D11.F1 ; also sheet 3
S_: D09.R2(S2:IN3) D11.E1 ; also sheet 3
S_SET_: C11.C1(D1:IN3) D10.E1(E1:OUT) D11.C1(E1:D)
STORE_: D07.D2(F2:IN1) D09.P1(U1:IN1) D10.S1(S1:OUT) ; also sheet 5
TP3: C08.J2(D:IN2) D09.U2(V1:IN2) ; also sheet 2,7,21,22,26,27,30
TP4: D11.B1(E1:C) D11.D2(H2:C) ; also sheet 2,4,7,8
TS1: C07.V2(S:IN1) ; also sheet 2,5,6
TS2: C11.H1(J1:IN3) C11.J2(M2:IN1) D09.B1(D1:IN2) D10.F1(L1:IN1) ; also sheet 2,5,6,7
TS3: C11.K1(N1:IN1) C11.N2(S2:IN1) D09.D2(H2:IN1) D10.P1(S1:IN3) D10.T2(V2:IN3) ; also sheet 2,5,6,22
TT_AC_LOAD_: D09.V1(V1:OUT) ; also sheet 7
TT_CARRY_INSERT: C09.P1(S1:IN1) D09.N1(N1:OUT) ; also sheet 7
TT_CARRY_INSERT_: C09.S1(S1:OUT) ; also sheet 5,6
TT_CARRY_INSERT_C_: D09.H2(H2:OUT) D09.K1(N1:IN1)
TT_CARRY_INSERT_S: C09.S2(S2:OUT) ; also sheet 13
TT_CARRY_INSERT_S_: C09.P2(S2:IN1) C11.S2(S2:OUT) D09.L1(N1:IN2)
TT_CYCLE_: C10.N1(N1:OUT) ; also sheet 6
TT_DATA: C10.N2(N2:OUT) ; also sheet 9
TT_INCREMENT_: D10.L1(L1:OUT) ; also sheet 6
TT_INST: C10.F2(F2:OUT) C11.M1(N1:IN3) D10.A1(E1:IN1)
TT_INST_: C10.E2(F2:IN2) C10.M1(N1:IN2) D09.P2(S2:IN2) D10.P2(P2:OUT) ; also sheet 2,9,14
TT_IO_ENABLE_: C11.F2(H2:IN3) C11.N1(N1:OUT) D09.S1(U1:IN3) ; also sheet 5
TT_L_DISABLE: C10.L1(N1:IN1) D09.S2(S2:OUT) ; also sheet 5
TT_LINE_SHIFT_: C09.D2(F2:IN1) C11.M2(M2:OUT) ; also sheet 10,11,12,13
TT_RIGHT_SHIFT_ENABLE: C10.E1(F1:IN2) C11.H2(H2:OUT)
TT_RIGHT_SHIFT_ENABLE_: C09.E2(F2:IN2) C10.F1(F1:OUT) ; also sheet 6
TT_SET_: C10.C1(C1:OUT) ; also sheet 4,5
TT_SHIFT_ENABLE: C09.F2(F2:OUT) C09.H1(K1:IN1) ; also sheet 9
TT_SHIFT_ENABLE_: C09.K1(K1:OUT) ; also sheet 6
Unconnected: C09.T2(V2:IN1) C09.U1 C09.U2(V2:IN2) C09.V1 C09.V2(V2:OUT) C10.U1 C10.V1 D04.S2 D05.F1(L1:IN) D05.H1(L1:IN2) D05.J1(L1:IN3) D05.K1(L1:IN4) D05.K2(P2:IN) D05.L1(L1:OUT) D05.L2(P2:IN2) D05.M1(S1:IN) D05.M2(P2:IN3) D05.N1(S1:IN2) D05.N2(P2:IN4) D05.P1(S1:IN3) D05.P2(P2:OUT) D05.R1(S1:IN4) D05.R2(V2:IN) D05.S1(S1:OUT) D05.S2(V2:IN2) D05.T2(V2:IN3) D05.U2(V2:IN4) D05.V2(V2:OUT) D09.J2(M2:IN1) D09.K2(M2:IN2) D09.L2(M2:IN3) D09.M2(M2:OUT) D11.H1(L1:C) D11.J1(L1:D) D11.K1(L1:S) D11.L1 D11.M1 D11.N1(S1:C) D11.P1(S1:D) D11.R1(S1:S) D11.S1 D11.S2(V2:C) D11.T2(V2:D) D11.U1 D11.U2(V2:S) D11.V1 D11.V2

### Notes on the sheet
- D-BS-dl8i-0-2 Data Line Interface

## Sheet 30 of 40
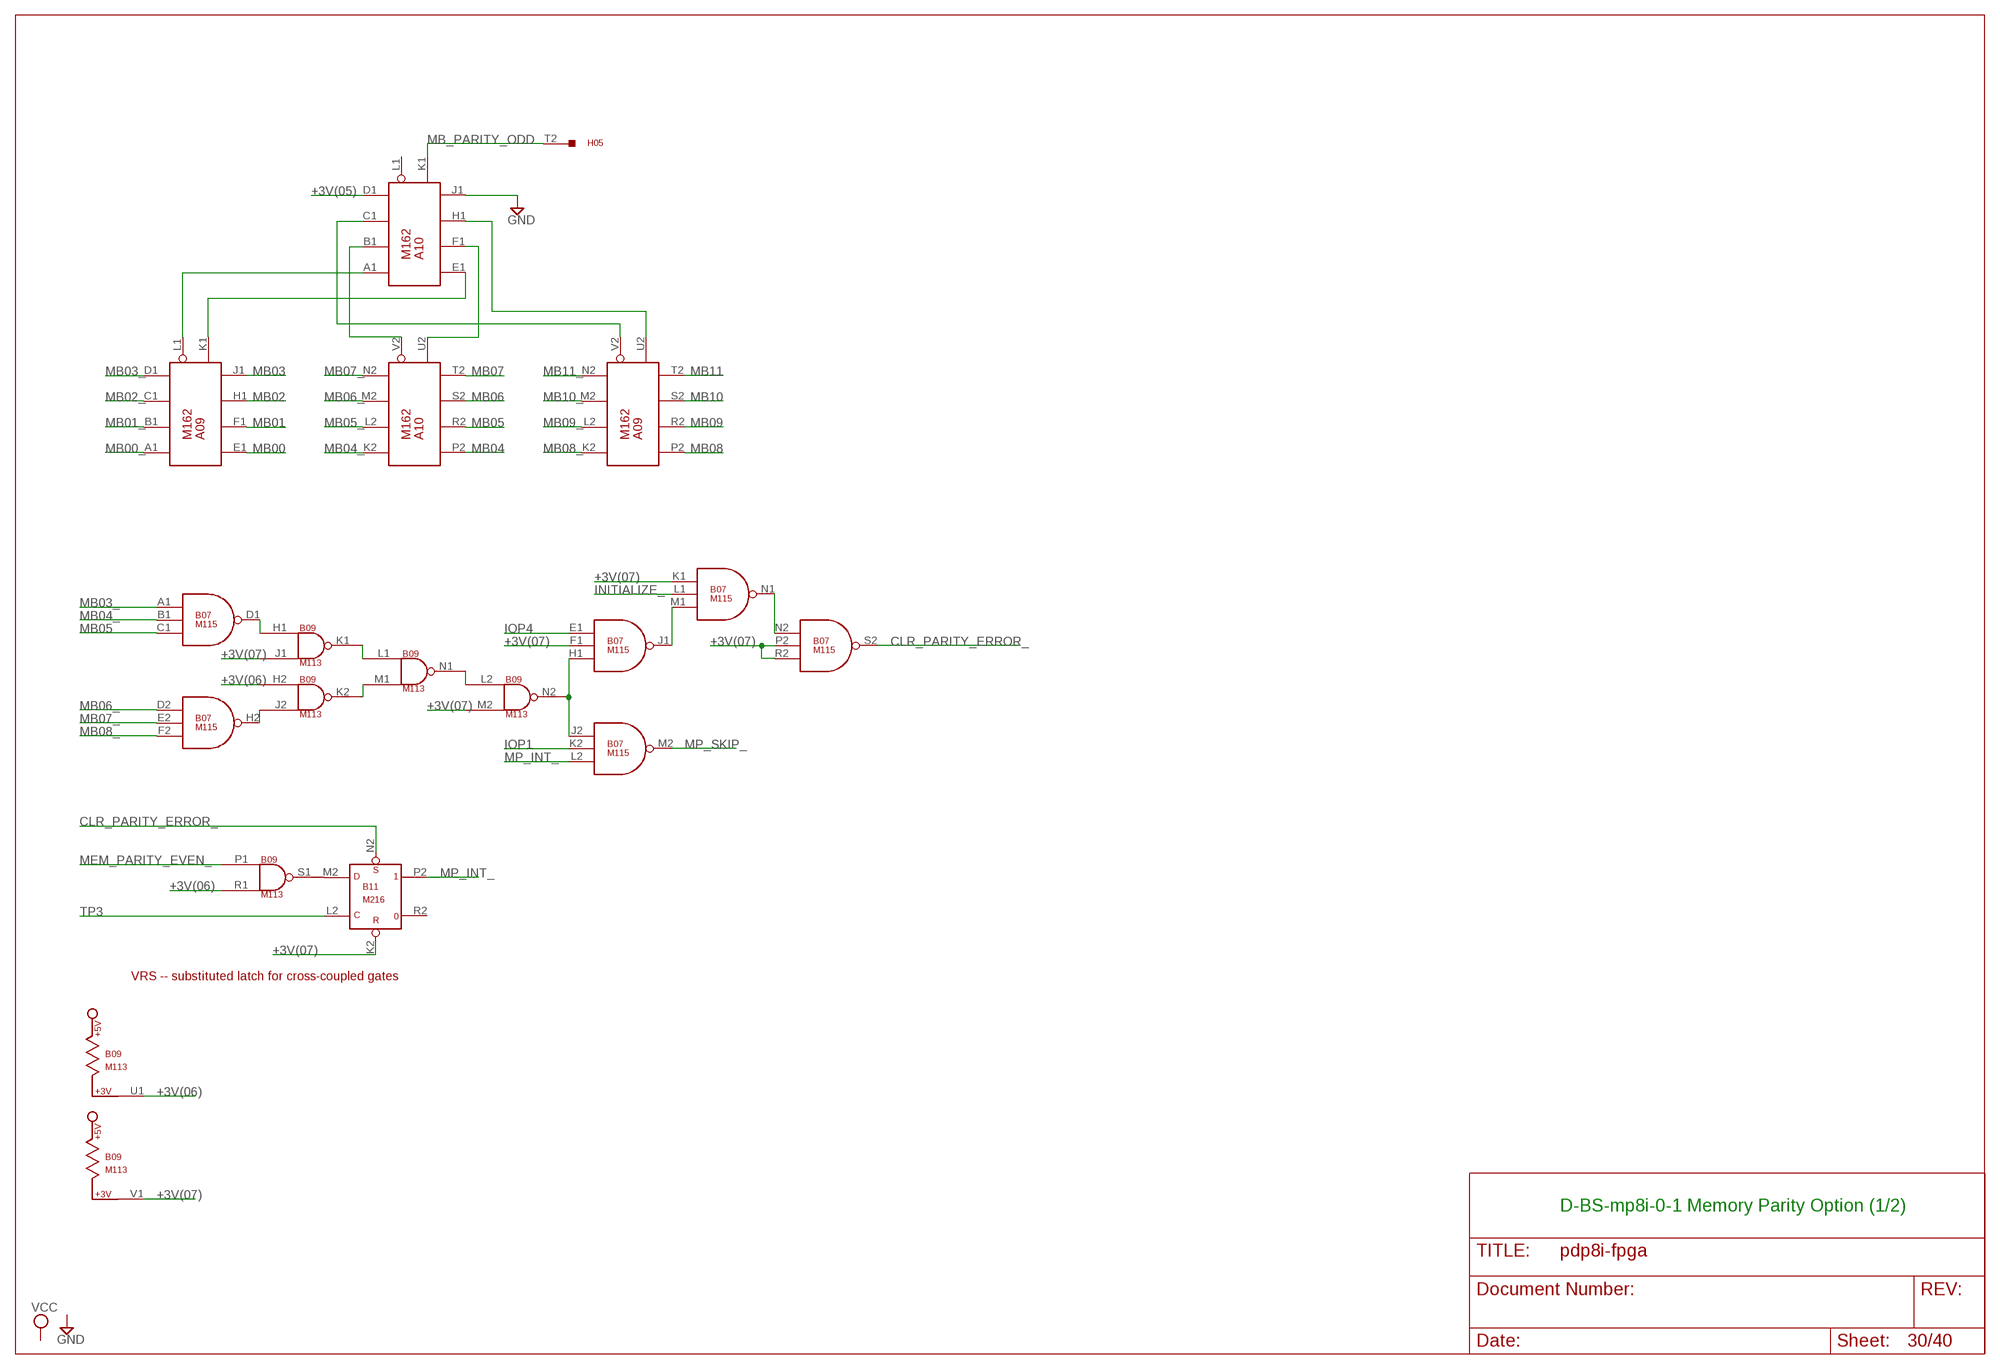
[diagram p30: schematic, sheet 30]

### Parts
A09  M162  [H807]
A10  M162  [H807]
B07  M115  [H807]
B09  M113  [H807]

### Nets
+3V(05): A10.D1(K1:8B) ; also sheet 31
+3V(06): B09.H2(K2:IN1) B09.R1(S1:IN2) B09.U1 ; also sheet 31
+3V(07): B07.F1(J1:IN2) B07.K1(N1:IN1) B07.P2(S2:IN2) B07.R2(S2:IN3) B09.J1(K1:IN2) B09.M2(N2:IN2) B09.V1 B11.K2(P2:R)
CLR_PARITY_ERROR_: B07.S2(S2:OUT) B11.N2(P2:S)
GND [Suppply]: A10.J1(K1:8A) ; also sheet 2,5,9,10,11,12,13,14,15,22,26,27,33,34,35,39
INITIALIZE_: B07.L1(N1:IN2) ; also sheet 2,14,26,32,35,36,37,38,39
IOP1: B07.K2(M2:IN2) ; also sheet 2,15,16,33,34,35,36
IOP4: B07.E1(J1:IN1) ; also sheet 2,15,16,33,34,35,36
MB00: A09.E1(K1:1A) ; also sheet 9,14,21
MB00_: A09.A1(K1:1B) ; also sheet 9
MB01: A09.F1(K1:2A) ; also sheet 9,14,21
MB01_: A09.B1(K1:2B) ; also sheet 9
MB02: A09.H1(K1:4A) ; also sheet 9,14,21
MB02_: A09.C1(K1:4B) ; also sheet 9
MB03: A09.J1(K1:8A) ; also sheet 4,5,9,14,21,27,29,34,38
MB03_: A09.D1(K1:8B) B07.A1(D1:IN1) ; also sheet 4,5,6,7,8,9,14,15,16,22,32,33,35,36,37
MB04: A10.P2(U2:1A) ; also sheet 5,9,14,21,22,38
MB04_: A10.K2(U2:1B) B07.B1(D1:IN2) ; also sheet 5,8,9,14,15,16,27,29,32,33,34,35,36,37
MB05: A10.R2(U2:2A) B07.C1(D1:IN3) ; also sheet 5,7,9,14,21,27,32,34,37
MB05_: A10.L2(U2:2B) ; also sheet 5,8,9,14,15,16,22,29,33,35,36,38
MB06: A10.S2(U2:4A) ; also sheet 5,7,9,14,16,21,22,27,33,38
MB06_: A10.M2(U2:4B) B07.D2(H2:IN1) ; also sheet 5,8,9,14,15,22,29,32,34,35,36,37,38
MB07: A10.T2(U2:8A) ; also sheet 5,7,9,14,15,21,22,26,27,33,34,35,37,38
MB07_: A10.N2(U2:8B) B07.E2(H2:IN2) ; also sheet 5,8,9,14,16,22,26,28,29,32,33,34,36
MB08: A09.P2(U2:1A) ; also sheet 6,7,9,14,15,21,22,26,27,33,34,36,37,38
MB08_: A09.K2(U2:1B) B07.F2(H2:IN3) ; also sheet 6,7,8,9,14,16,22,26,28,29,32,33,34,35
MB09: A09.R2(U2:2A) ; also sheet 2,5,6,9,14,21,22,27,29,37
MB09_: A09.L2(U2:2B) ; also sheet 6,9,26,27,28,33,37
MB10: A09.S2(U2:4A) ; also sheet 2,6,8,9,14,21,22,27,29,33,37
MB10_: A09.M2(U2:4B) ; also sheet 6,8,9,22,26,27,28,37
MB11: A09.T2(U2:8A) ; also sheet 2,6,9,14,21,22,27,29,33,37
MB11_: A09.N2(U2:8B) ; also sheet 2,5,7,8,9,22,26,28,29
MB_PARITY_ODD: A10.K1(K1:ODD) H05.T2
MEM_PARITY_EVEN_: B09.P1(S1:IN1) ; also sheet 31
MP_INT_: B07.L2(M2:IN3) B11.P2 ; also sheet 14
MP_SKIP_: B07.M2(M2:OUT) ; also sheet 14
N$26: B09.S1(S1:OUT) B11.M2(P2:D)
N$262: A09.L1(K1:EVEN) A10.A1(K1:1B)
N$687: A09.K1(K1:ODD) A10.E1(K1:1A)
N$689: A10.B1(K1:2B) A10.V2(U2:EVEN)
N$690: A10.F1(K1:2A) A10.U2(U2:ODD)
N$691: A09.V2(U2:EVEN) A10.C1(K1:4B)
N$692: A09.U2(U2:ODD) A10.H1(K1:4A)
N$693: B07.D1(D1:OUT) B09.H1(K1:IN1)
N$694: B07.H2(H2:OUT) B09.J2(K2:IN2)
N$695: B09.K1(K1:OUT) B09.L1(N1:IN1)
N$696: B09.K2(K2:OUT) B09.M1(N1:IN2)
N$697: B07.H1(J1:IN3) B07.J2(M2:IN1) B09.N2(N2:OUT)
N$698: B09.L2(N2:IN1) B09.N1(N1:OUT)
N$699: B07.J1(J1:OUT) B07.M1(N1:IN3)
N$700: B07.N1(N1:OUT) B07.N2(S2:IN1)
TP3: B11.L2(P2:C) ; also sheet 2,7,21,22,26,27,29
Unconnected: A10.L1(K1:EVEN) B07.P1(U1:IN1) B07.R1(U1:IN2) B07.S1(U1:IN3) B07.T2(V1:IN1) B07.U1(U1:OUT) B07.U2(V1:IN2) B07.V1(V1:OUT) B07.V2(V1:IN3) B09.P2(S2:IN1) B09.R2(S2:IN2) B09.S2(S2:OUT) B09.T2(V2:IN1) B09.U2(V2:IN2) B09.V2(V2:OUT) B11.R2

### Notes on the sheet
- VRS -- substituted latch for cross-coupled gates
- D-BS-mp8i-0-1 Memory Parity Option (1/2)

## Sheet 31 of 40
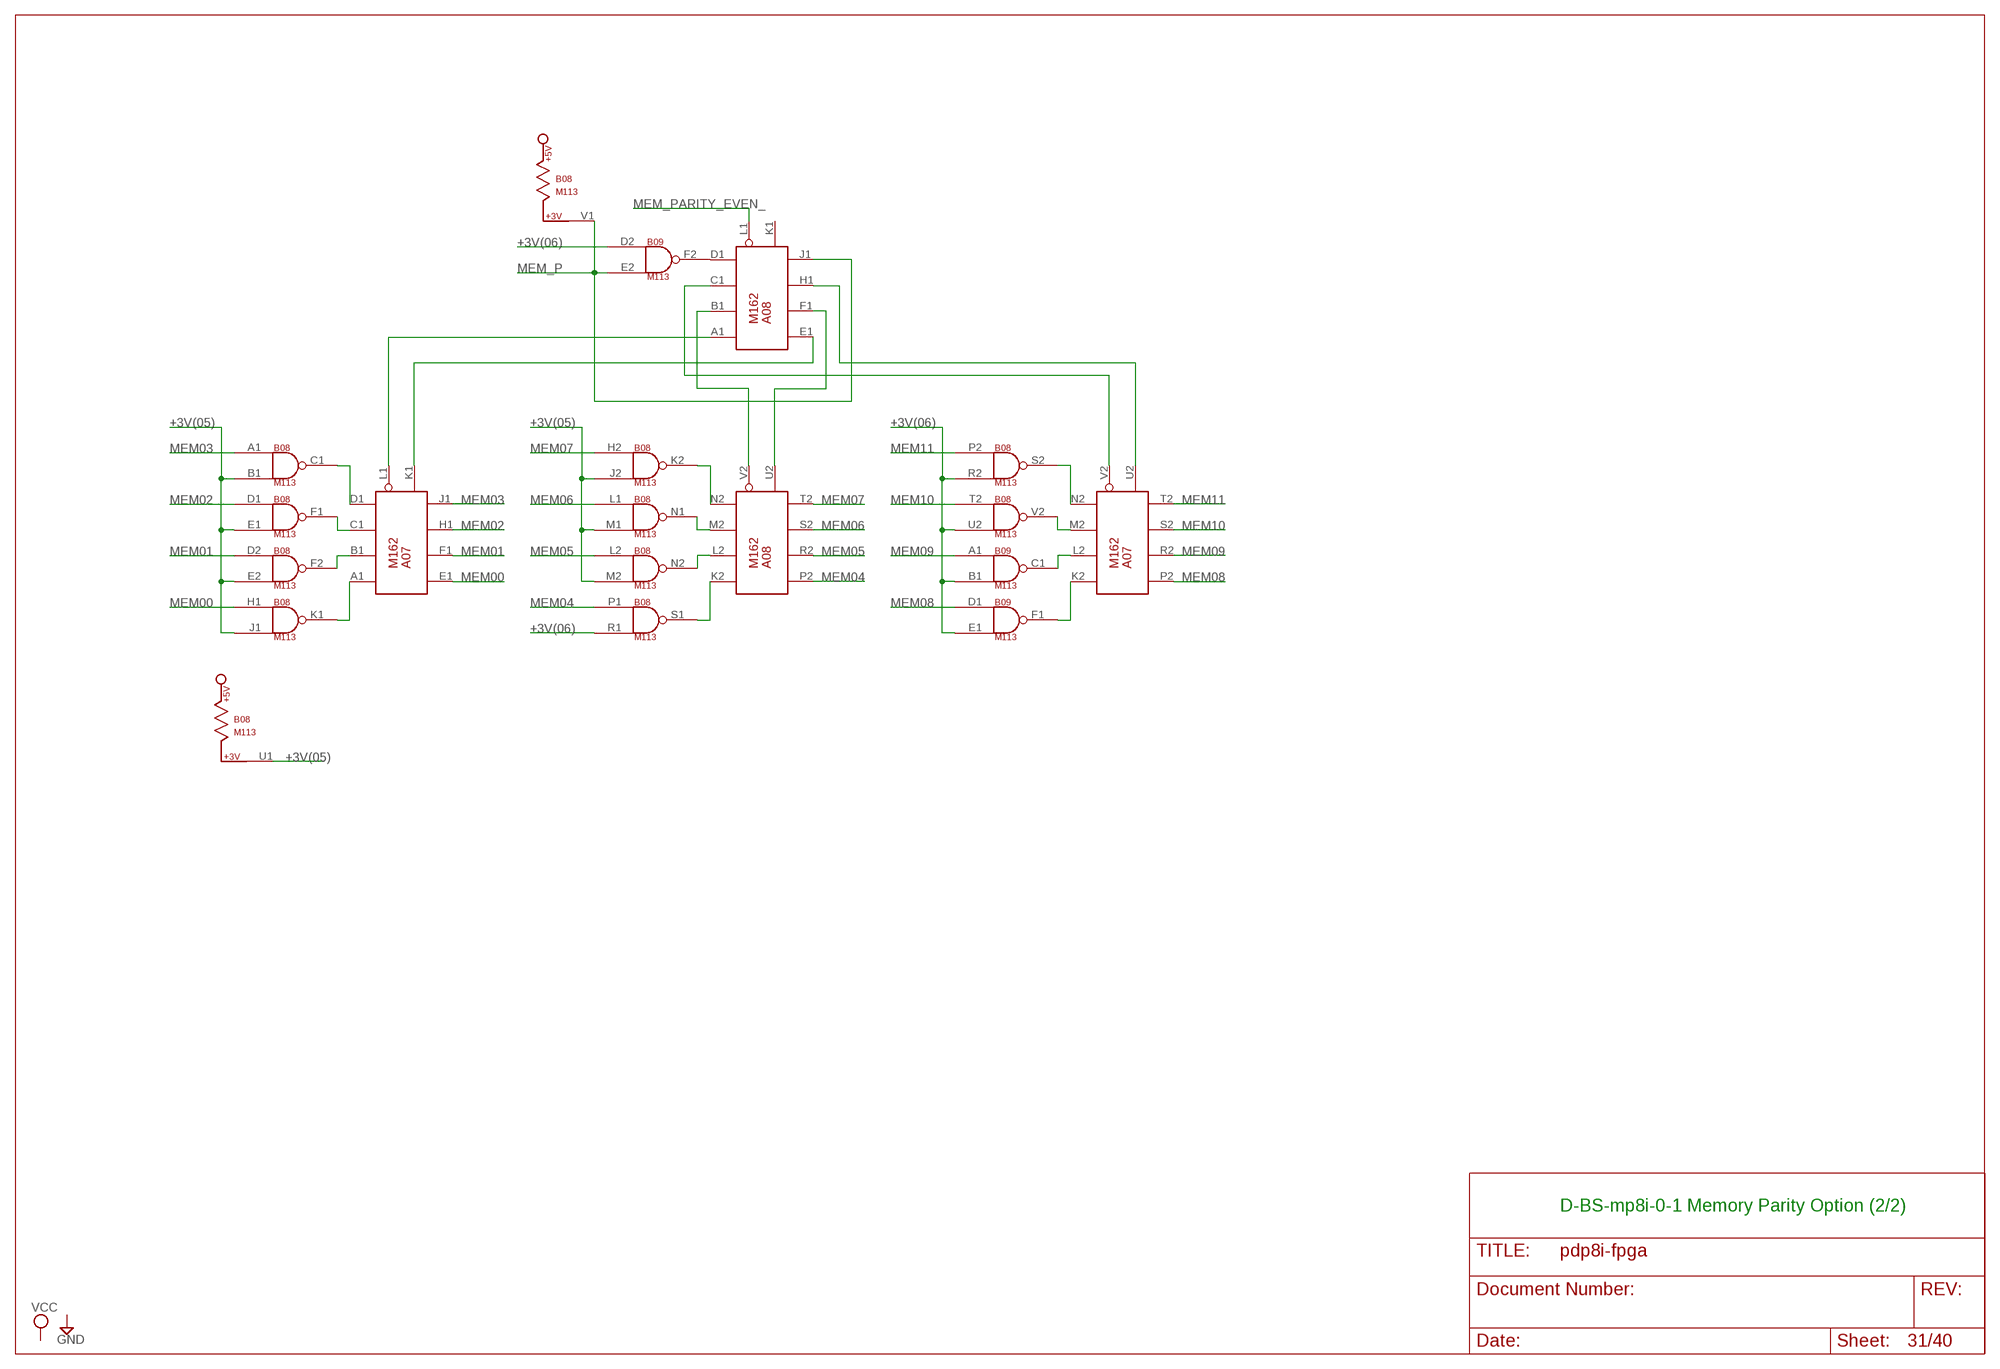
[diagram p31: schematic, sheet 31]

### Parts
A07  M162  [H807]
A08  M162  [H807]
B08  M113  [H807]

### Nets
+3V(05): B08.B1(C1:IN2) B08.E1(F1:IN2) B08.E2(F2:IN2) B08.J1(K1:IN2) B08.J2(K2:IN2) B08.M1(N1:IN2) B08.M2(N2:IN2) B08.U1 ; also sheet 30
+3V(06): B08.R1(S1:IN2) B08.R2(S2:IN2) B08.U2(V2:IN2) B09.B1(C1:IN2) B09.D2(F2:IN1) B09.E1(F1:IN2) ; also sheet 30
MEM00: A07.E1(K1:1A) B08.H1(K1:IN1) ; also sheet 4,10,18,29
MEM01: A07.F1(K1:2A) B08.D2(F2:IN1) ; also sheet 4,10,18
MEM02: A07.H1(K1:4A) B08.D1(F1:IN1) ; also sheet 4,10,18
MEM03: A07.J1(K1:8A) B08.A1(C1:IN1) ; also sheet 11,18
MEM04: A08.P2(U2:1A) B08.P1(S1:IN1) ; also sheet 11,18
MEM05: A08.R2(U2:2A) B08.L2(N2:IN1) ; also sheet 11,18
MEM06: A08.S2(U2:4A) B08.L1(N1:IN1) ; also sheet 12,18
MEM07: A08.T2(U2:8A) B08.H2(K2:IN1) ; also sheet 12,18
MEM08: A07.P2(U2:1A) B09.D1(F1:IN1) ; also sheet 12,18
MEM09: A07.R2(U2:2A) B09.A1(C1:IN1) ; also sheet 13,18,29
MEM10: A07.S2(U2:4A) B08.T2(V2:IN1) ; also sheet 13,18
MEM11: A07.T2(U2:8A) B08.P2(S2:IN1) ; also sheet 13,18
MEM_P: A08.J1(K1:8A) B08.V1 B09.E2(F2:IN2) ; also sheet 18
MEM_PARITY_EVEN_: A08.L1(K1:EVEN) ; also sheet 30
N$702: A07.L1(K1:EVEN) A08.A1(K1:1B)
N$703: A07.K1(K1:ODD) A08.E1(K1:1A)
N$704: A08.B1(K1:2B) A08.V2(U2:EVEN)
N$705: A08.F1(K1:2A) A08.U2(U2:ODD)
N$706: A07.V2(U2:EVEN) A08.C1(K1:4B)
N$707: A07.U2(U2:ODD) A08.H1(K1:4A)
N$708: A08.M2(U2:4B) B08.N1(N1:OUT)
N$709: A08.L2(U2:2B) B08.N2(N2:OUT)
N$710: A08.K2(U2:1B) B08.S1(S1:OUT)
N$711: A08.N2(U2:8B) B08.K2(K2:OUT)
N$712: A07.M2(U2:4B) B08.V2(V2:OUT)
N$713: A07.B1(K1:2B) B08.F2(F2:OUT)
N$714: A07.C1(K1:4B) B08.F1(F1:OUT)
N$715: A07.D1(K1:8B) B08.C1(C1:OUT)
N$716: A07.A1(K1:1B) B08.K1(K1:OUT)
N$717: A07.L2(U2:2B) B09.C1(C1:OUT)
N$718: A07.K2(U2:1B) B09.F1(F1:OUT)
N$719: A07.N2(U2:8B) B08.S2(S2:OUT)
N$720: A08.D1(K1:8B) B09.F2(F2:OUT)
Unconnected: A08.K1(K1:ODD)

### Notes on the sheet
- D-BS-mp8i-0-1 Memory Parity Option (2/2)

## Sheet 32 of 40
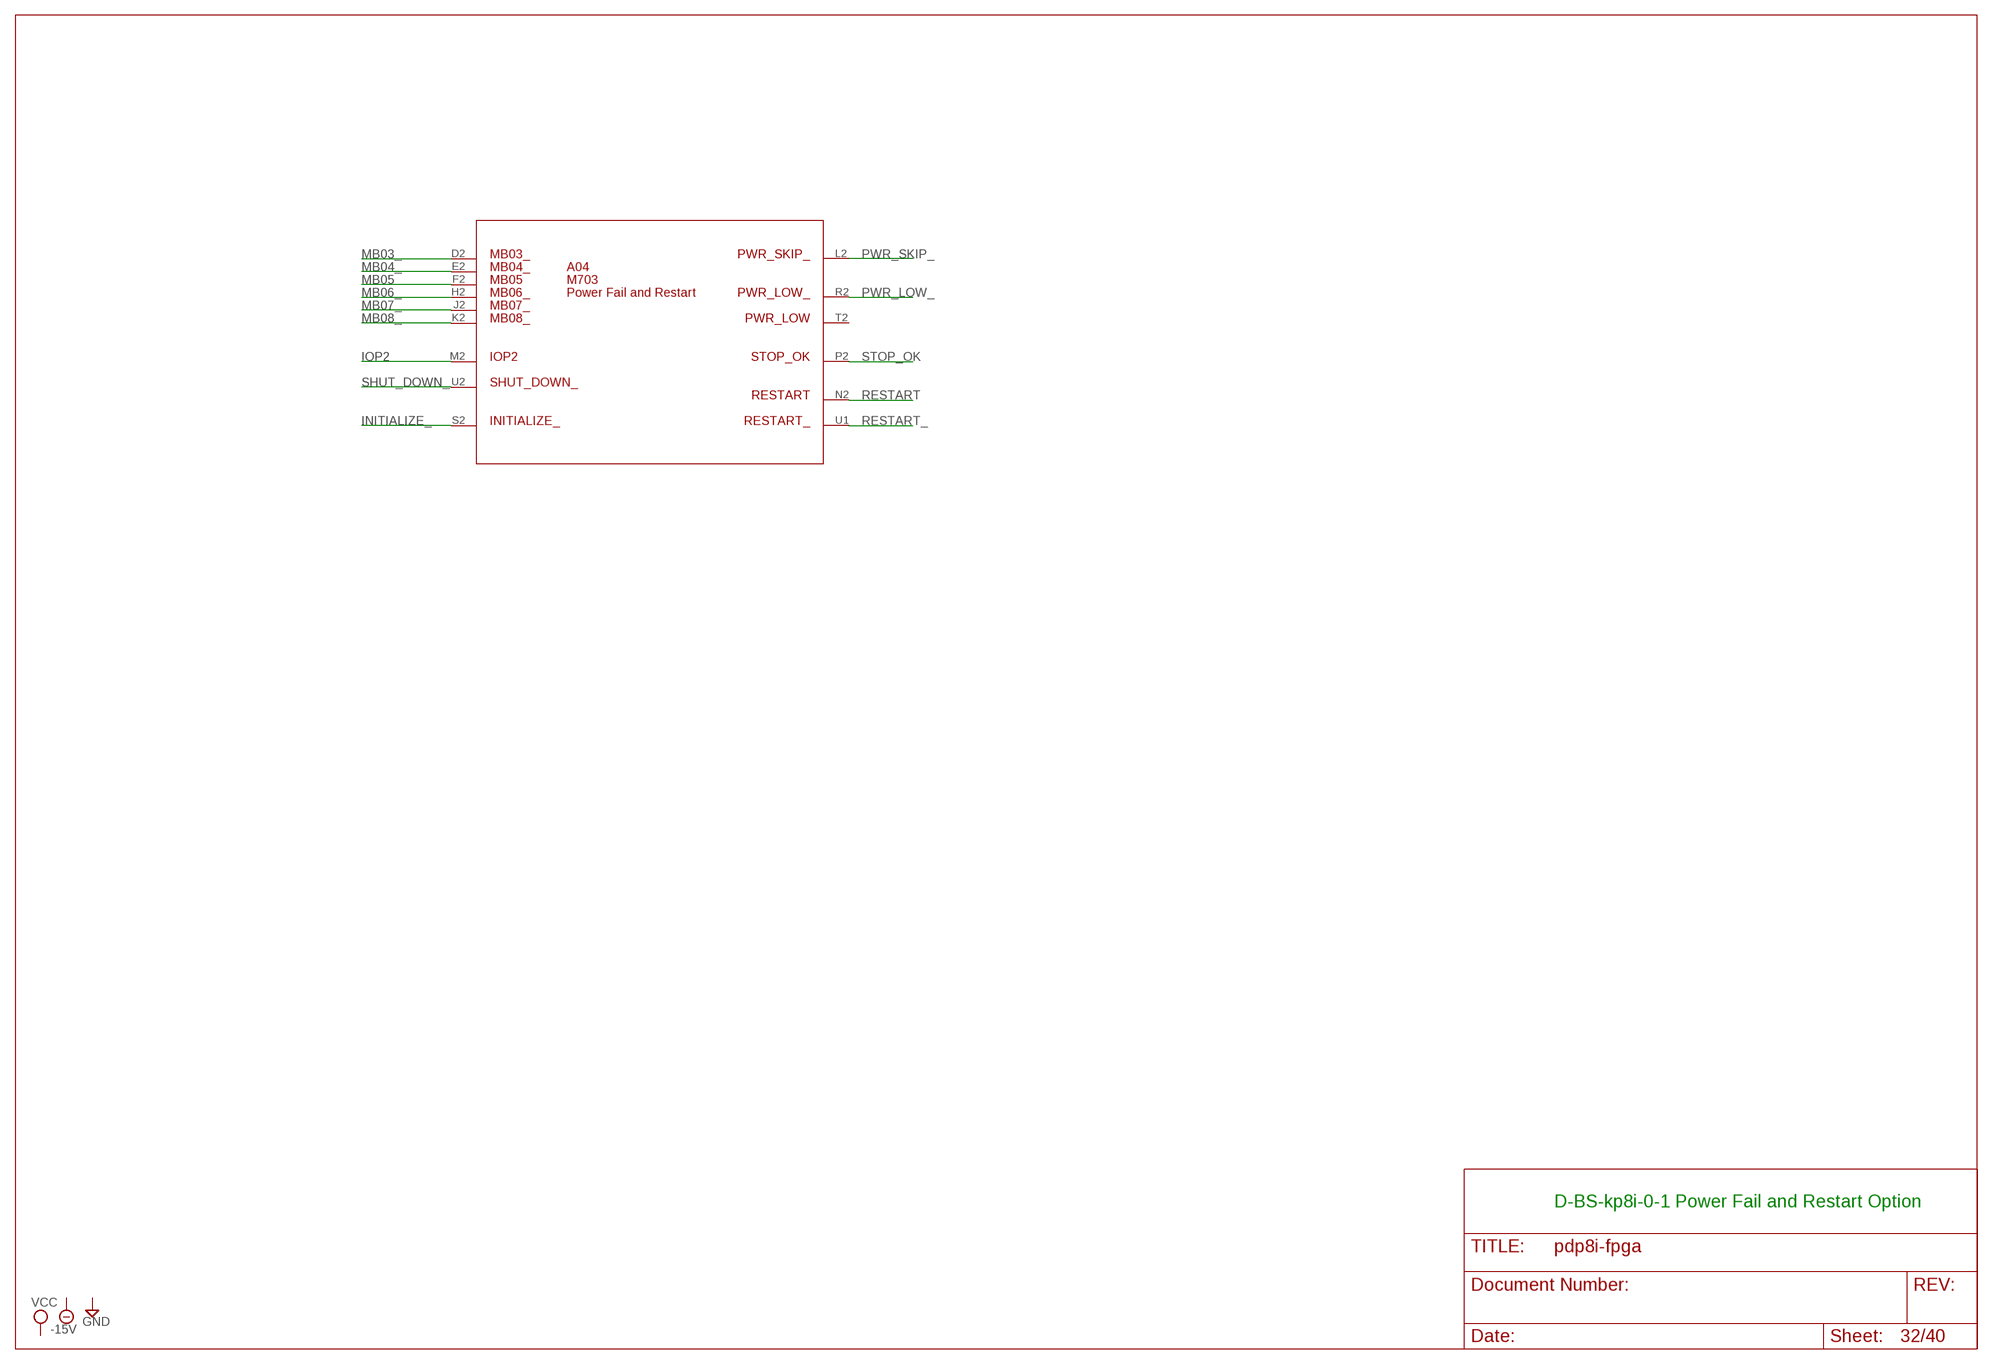
[diagram p32: schematic, sheet 32]

### Parts
A04  M703  [H807]

### Nets
INITIALIZE_: A04.S2 ; also sheet 2,14,26,30,35,36,37,38,39
IOP2: A04.M2 ; also sheet 2,15,16,33,34,35,36
MB03_: A04.D2 ; also sheet 4,5,6,7,8,9,14,15,16,22,30,33,35,36,37
MB04_: A04.E2 ; also sheet 5,8,9,14,15,16,27,29,30,33,34,35,36,37
MB05: A04.F2 ; also sheet 5,7,9,14,21,27,30,34,37
MB06_: A04.H2 ; also sheet 5,8,9,14,15,22,29,30,34,35,36,37,38
MB07_: A04.J2 ; also sheet 5,8,9,14,16,22,26,28,29,30,33,34,36
MB08_: A04.K2 ; also sheet 6,7,8,9,14,16,22,26,28,29,30,33,34,35
PWR_LOW_: A04.R2 ; also sheet 16
PWR_SKIP_: A04.L2 ; also sheet 16
RESTART: A04.N2 ; also sheet 21
RESTART_: A04.U1 ; also sheet 2,5
SHUT_DOWN_: A04.U2 ; also sheet 17
STOP_OK: A04.P2 ; also sheet 2,17
Unconnected: A04.T2

### Notes on the sheet
- D-BS-kp8i-0-1 Power Fail and Restart Option

## Sheet 33 of 40
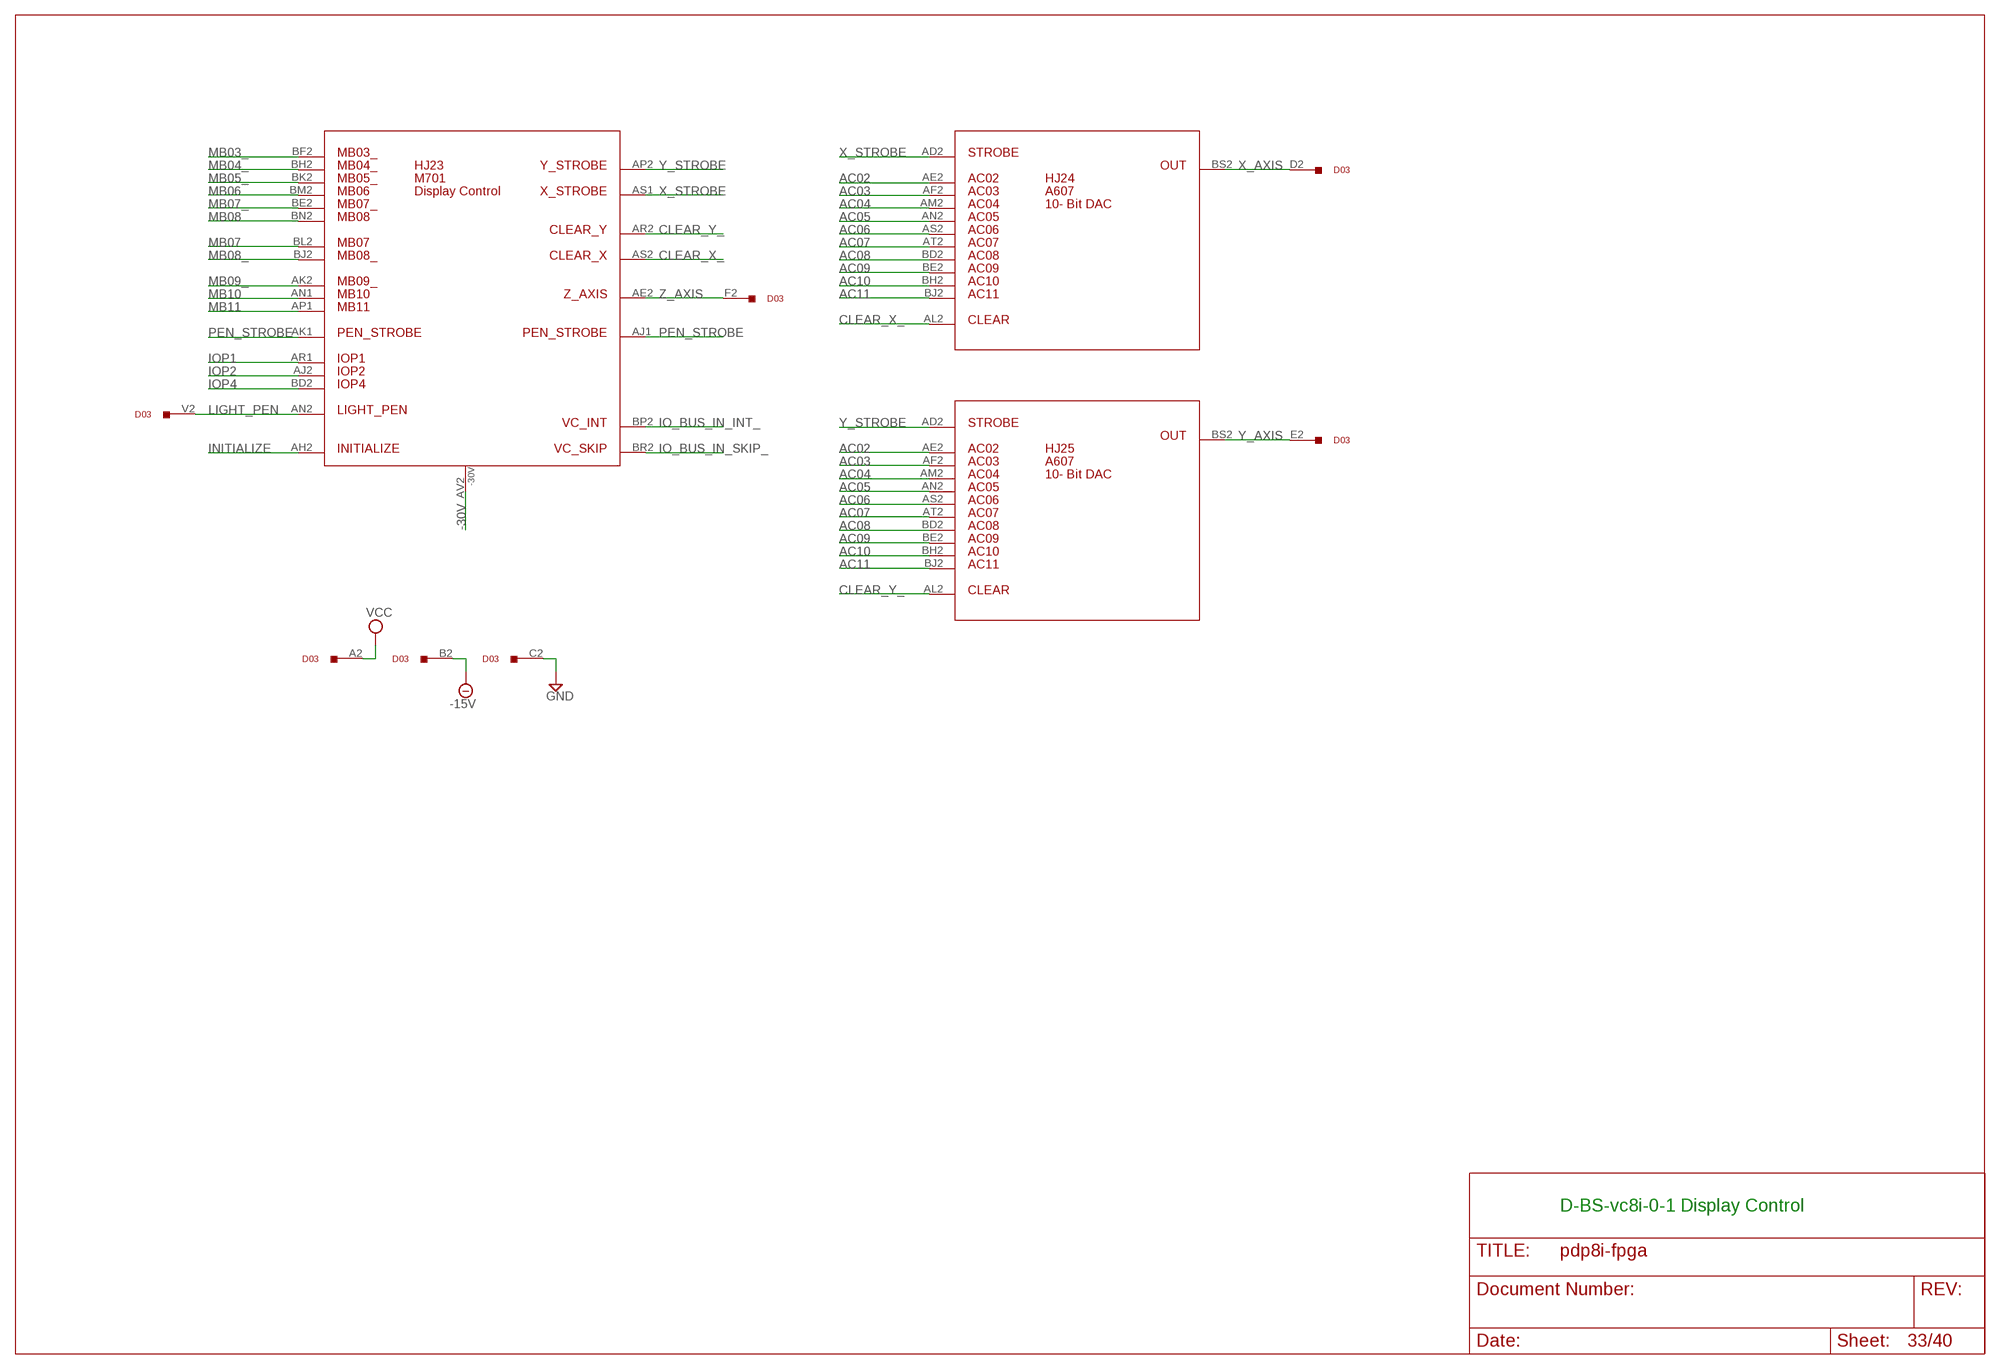
[diagram p33: schematic, sheet 33]

### Parts
D03  W023  [H807]
HJ23  M701  [H807-2]
HJ24  A607  [H807-2]
HJ25  A607  [H807-2]

### Nets
-15V [Suppply]: D03.B2 ; also sheet 36
-30V [Suppply]: HJ23.AV2(-30V) ; also sheet 15,17
AC02: HJ24.AE2 HJ25.AE2 ; also sheet 9,14,27,28,37
AC03: HJ24.AF2 HJ25.AF2 ; also sheet 9,14,28,37
AC04: HJ24.AM2 HJ25.AM2 ; also sheet 9,14,16,28,35,37
AC05: HJ24.AN2 HJ25.AN2 ; also sheet 9,14,16,28,35,37
AC06: HJ24.AS2 HJ25.AS2 ; also sheet 9,14,16,28,35,37
AC07: HJ24.AT2 HJ25.AT2 ; also sheet 9,14,16,28,35,37
AC08: HJ24.BD2 HJ25.BD2 ; also sheet 9,14,16,28,35,37
AC09: HJ24.BE2 HJ25.BE2 ; also sheet 9,14,16,28,35,37
AC10: HJ24.BH2 HJ25.BH2 ; also sheet 9,14,16,28,35,37
AC11: HJ24.BJ2 HJ25.BJ2 ; also sheet 9,14,16,28,35,37
CLEAR_X_: HJ23.AS2 HJ24.AL2
CLEAR_Y_: HJ23.AR2 HJ25.AL2
GND [Suppply]: D03.C2 ; also sheet 2,5,9,10,11,12,13,14,15,22,26,27,30,34,35,39
INITIALIZE: HJ23.AH2 ; also sheet 2,15,16,34,36
IO_BUS_IN_INT_: HJ23.BP2 ; also sheet 14,34,35,36,37,38
IO_BUS_IN_SKIP_: HJ23.BR2 ; also sheet 14,34,35,36,37,38
IOP1: HJ23.AR1 ; also sheet 2,15,16,30,34,35,36
IOP2: HJ23.AJ2 ; also sheet 2,15,16,32,34,35,36
IOP4: HJ23.BD2 ; also sheet 2,15,16,30,34,35,36
LIGHT_PEN: D03.V2 HJ23.AN2
MB03_: HJ23.BF2 ; also sheet 4,5,6,7,8,9,14,15,16,22,30,32,35,36,37
MB04_: HJ23.BH2 ; also sheet 5,8,9,14,15,16,27,29,30,32,34,35,36,37
MB05_: HJ23.BK2 ; also sheet 5,8,9,14,15,16,22,29,30,35,36,38
MB06: HJ23.BM2 ; also sheet 5,7,9,14,16,21,22,27,30,38
MB07: HJ23.BL2 ; also sheet 5,7,9,14,15,21,22,26,27,30,34,35,37,38
MB07_: HJ23.BE2 ; also sheet 5,8,9,14,16,22,26,28,29,30,32,34,36
MB08: HJ23.BN2 ; also sheet 6,7,9,14,15,21,22,26,27,30,34,36,37,38
MB08_: HJ23.BJ2 ; also sheet 6,7,8,9,14,16,22,26,28,29,30,32,34,35
MB09_: HJ23.AK2 ; also sheet 6,9,26,27,28,30,37
MB10: HJ23.AN1 ; also sheet 2,6,8,9,14,21,22,27,29,30,37
MB11: HJ23.AP1 ; also sheet 2,6,9,14,21,22,27,29,30,37
PEN_STROBE: HJ23.AJ1 HJ23.AK1
VCC [Suppply]: D03.A2 ; also sheet 9,12
X_AXIS: D03.D2 HJ24.BS2
X_STROBE: HJ23.AS1 HJ24.AD2
Y_AXIS: D03.E2 HJ25.BS2
Y_STROBE: HJ23.AP2 HJ25.AD2
Z_AXIS: D03.F2 HJ23.AE2
Unconnected: D03.H2 D03.J2 D03.K2 D03.L2 D03.M2 D03.N2 D03.P2 D03.R2 D03.S2 D03.T2 D03.U2

### Notes on the sheet
- D-BS-vc8i-0-1 Display Control

## Sheet 34 of 40
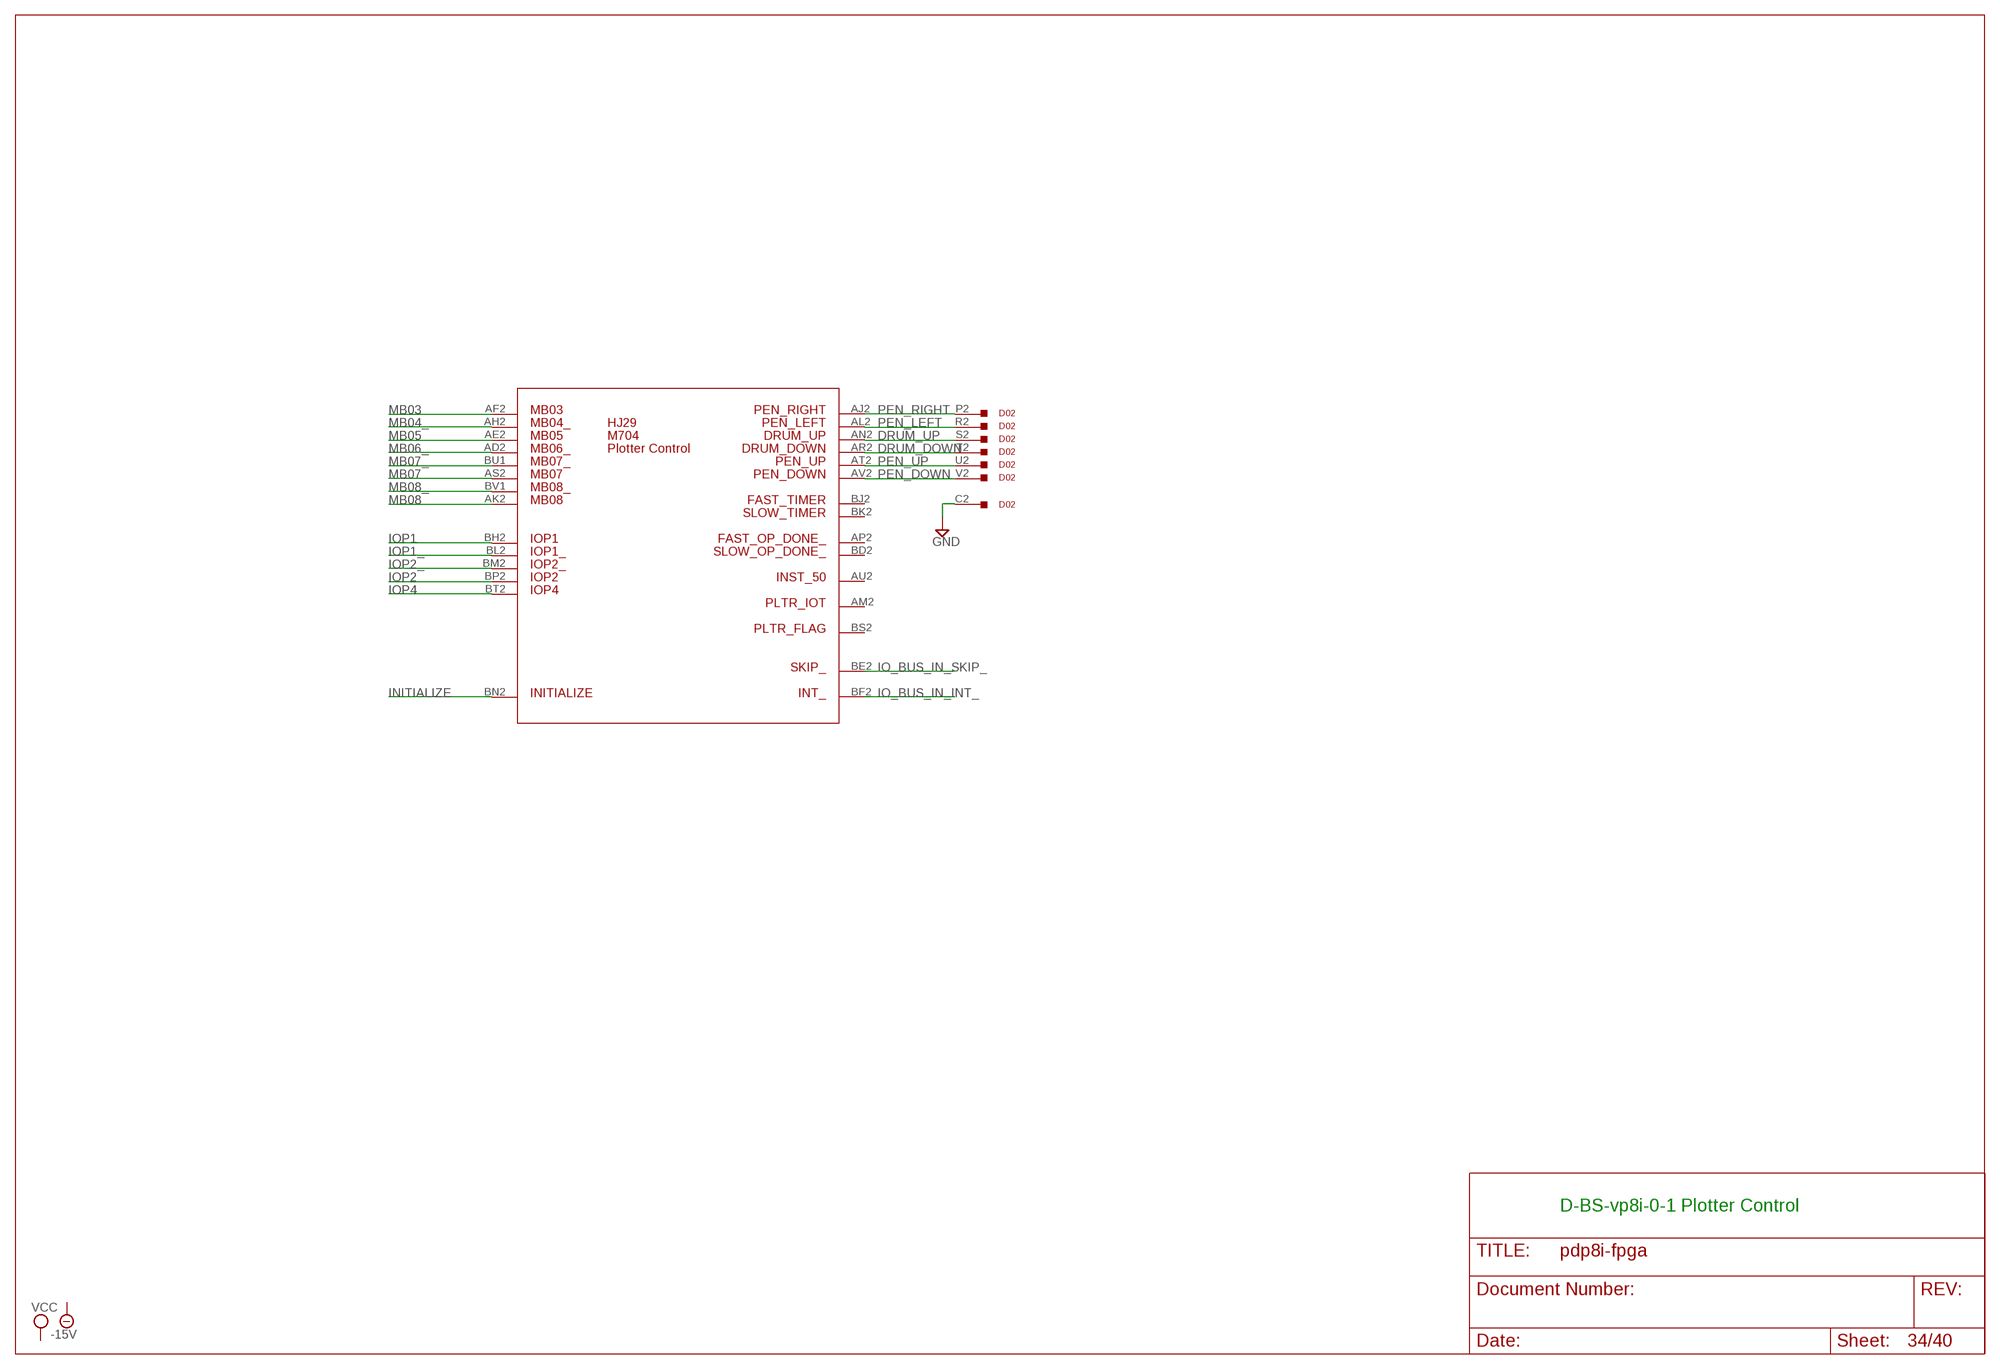
[diagram p34: schematic, sheet 34]

### Parts
D02  W023  [H807]
HJ29  M704  [H807-2]

### Nets
DRUM_DOWN: D02.T2 HJ29.AR2
DRUM_UP: D02.S2 HJ29.AN2
GND [Suppply]: D02.C2 ; also sheet 2,5,9,10,11,12,13,14,15,22,26,27,30,33,35,39
INITIALIZE: HJ29.BN2 ; also sheet 2,15,16,33,36
IO_BUS_IN_INT_: HJ29.BF2 ; also sheet 14,33,35,36,37,38
IO_BUS_IN_SKIP_: HJ29.BE2 ; also sheet 14,33,35,36,37,38
IOP1: HJ29.BH2 ; also sheet 2,15,16,30,33,35,36
IOP1_: HJ29.BL2 ; also sheet 2,5,14,37
IOP2: HJ29.BP2 ; also sheet 2,15,16,32,33,35,36
IOP2_: HJ29.BM2 ; also sheet 2,5,14,37
IOP4: HJ29.BT2 ; also sheet 2,15,16,30,33,35,36
MB03: HJ29.AF2 ; also sheet 4,5,9,14,21,27,29,30,38
MB04_: HJ29.AH2 ; also sheet 5,8,9,14,15,16,27,29,30,32,33,35,36,37
MB05: HJ29.AE2 ; also sheet 5,7,9,14,21,27,30,32,37
MB06_: HJ29.AD2 ; also sheet 5,8,9,14,15,22,29,30,32,35,36,37,38
MB07: HJ29.AS2 ; also sheet 5,7,9,14,15,21,22,26,27,30,33,35,37,38
MB07_: HJ29.BU1 ; also sheet 5,8,9,14,16,22,26,28,29,30,32,33,36
MB08: HJ29.AK2 ; also sheet 6,7,9,14,15,21,22,26,27,30,33,36,37,38
MB08_: HJ29.BV1 ; also sheet 6,7,8,9,14,16,22,26,28,29,30,32,33,35
PEN_DOWN: D02.V2 HJ29.AV2
PEN_LEFT: D02.R2 HJ29.AL2
PEN_RIGHT: D02.P2 HJ29.AJ2
PEN_UP: D02.U2 HJ29.AT2
Unconnected: D02.A2 D02.B2 D02.D2 D02.E2 D02.F2 D02.H2 D02.J2 D02.K2 D02.L2 D02.M2 D02.N2 HJ29.AM2 HJ29.AP2 HJ29.AU2 HJ29.BD2 HJ29.BJ2 HJ29.BK2 HJ29.BS2

### Notes on the sheet
- D-BS-vp8i-0-1 Plotter Control

## Sheet 35 of 40
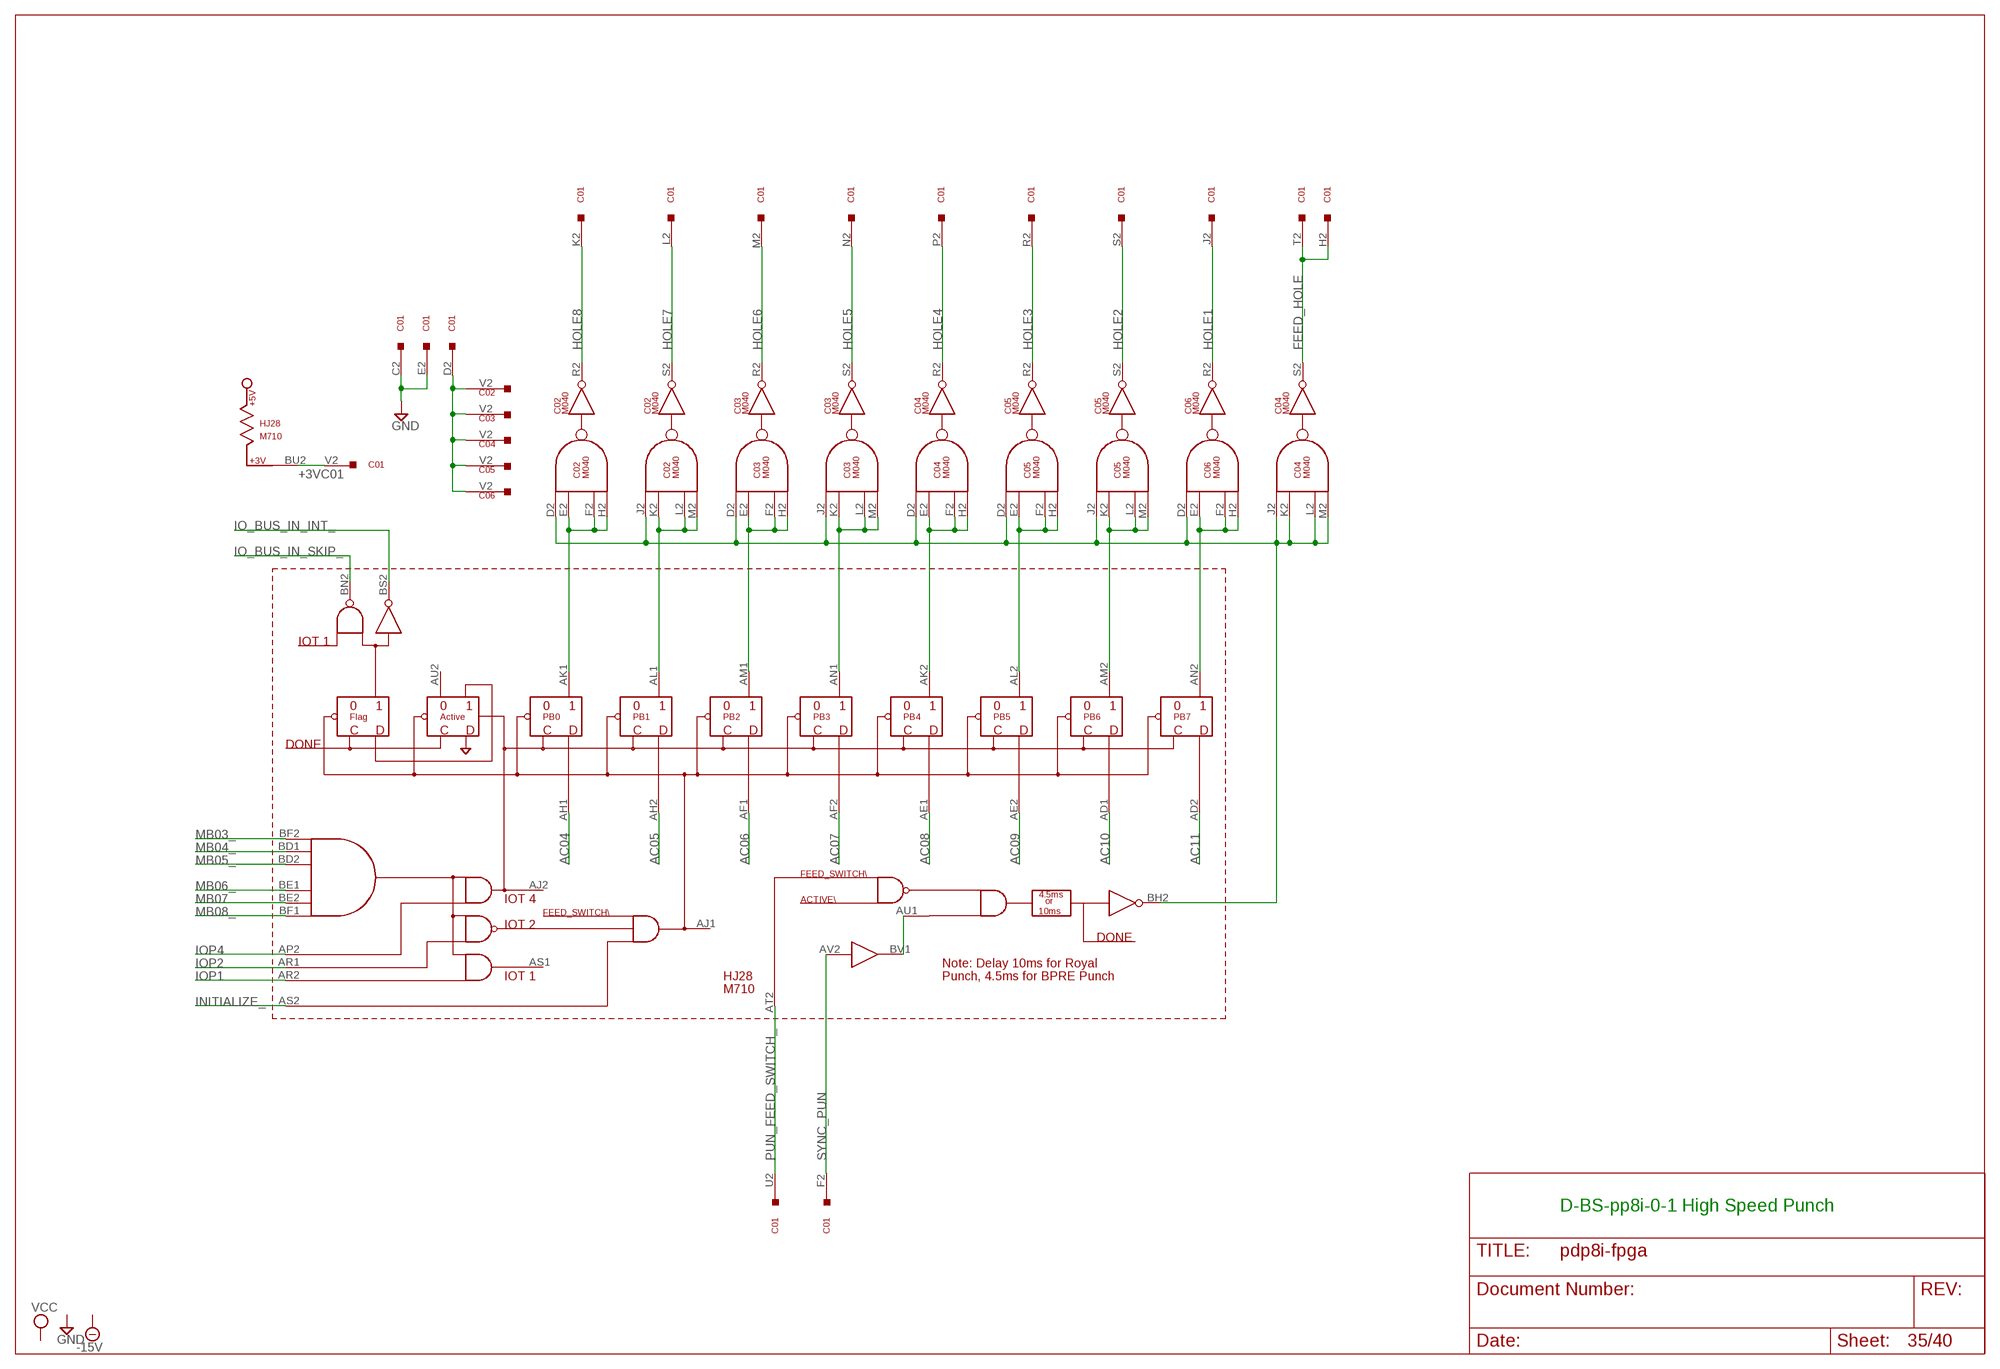
[diagram p35: schematic, sheet 35]

### Parts
C01  W023  [H807]
C02  M040  [H807]
C03  M040  [H807]
C04  M040  [H807]
C05  M040  [H807]
C06  M040  [H807]
HJ28  M710  [H807-2]

### Nets
+3VC01: C01.V2 HJ28.BU2
-36V: C01.D2 C02.V2 C03.V2 C04.V2 C05.V2 C06.V2
AC04: HJ28.AH1 ; also sheet 9,14,16,28,33,37
AC05: HJ28.AH2 ; also sheet 9,14,16,28,33,37
AC06: HJ28.AF1 ; also sheet 9,14,16,28,33,37
AC07: HJ28.AF2 ; also sheet 9,14,16,28,33,37
AC08: HJ28.AE1 ; also sheet 9,14,16,28,33,37
AC09: HJ28.AE2 ; also sheet 9,14,16,28,33,37
AC10: HJ28.AD1 ; also sheet 9,14,16,28,33,37
AC11: HJ28.AD2 ; also sheet 9,14,16,28,33,37
FEED_HOLE: C01.H2 C01.T2 C04.S2(R)
GND [Suppply]: C01.C2 C01.E2 ; also sheet 2,5,9,10,11,12,13,14,15,22,26,27,30,33,34,39
HOLE1: C01.J2 C06.R2(R)
HOLE2: C01.S2 C05.S2(R)
HOLE3: C01.R2 C05.R2(R)
HOLE4: C01.P2 C04.R2(R)
HOLE5: C01.N2 C03.S2(R)
HOLE6: C01.M2 C03.R2(R)
HOLE7: C01.L2 C02.S2(R)
HOLE8: C01.K2 C02.R2(R)
INITIALIZE_: HJ28.AS2 ; also sheet 2,14,26,30,32,36,37,38,39
IO_BUS_IN_INT_: HJ28.BS2 ; also sheet 14,33,34,36,37,38
IO_BUS_IN_SKIP_: HJ28.BN2 ; also sheet 14,33,34,36,37,38
IOP1: HJ28.AR2 ; also sheet 2,15,16,30,33,34,36
IOP2: HJ28.AR1 ; also sheet 2,15,16,32,33,34,36
IOP4: HJ28.AP2 ; also sheet 2,15,16,30,33,34,36
MB03_: HJ28.BF2 ; also sheet 4,5,6,7,8,9,14,15,16,22,30,32,33,36,37
MB04_: HJ28.BD1 ; also sheet 5,8,9,14,15,16,27,29,30,32,33,34,36,37
MB05_: HJ28.BD2 ; also sheet 5,8,9,14,15,16,22,29,30,33,36,38
MB06_: HJ28.BE1 ; also sheet 5,8,9,14,15,22,29,30,32,34,36,37,38
MB07: HJ28.BE2 ; also sheet 5,7,9,14,15,21,22,26,27,30,33,34,37,38
MB08_: HJ28.BF1 ; also sheet 6,7,8,9,14,16,22,26,28,29,30,32,33,34
N$721: HJ28.AU1 HJ28.BV1
N$722: C02.D2(D) C02.J2(D) C03.D2(D) C03.J2(D) C04.D2(D) C04.J2(D) C04.K2(E) C04.L2(F) C04.M2(H) C05.D2(D) C05.J2(D) C06.D2(D) HJ28.BH2
N$734: C02.E2(E) C02.F2(F) C02.H2(H) HJ28.AK1
N$735: C02.K2(E) C02.L2(F) C02.M2(H) HJ28.AL1
N$736: C06.E2(E) C06.F2(F) C06.H2(H) HJ28.AN2
N$737: C03.E2(E) C03.F2(F) C03.H2(H) HJ28.AM1
N$738: C03.K2(E) C03.L2(F) C03.M2(H) HJ28.AN1
N$739: C04.E2(E) C04.F2(F) C04.H2(H) HJ28.AK2
N$740: C05.E2(E) C05.F2(F) C05.H2(H) HJ28.AL2
N$741: C05.K2(E) C05.L2(F) C05.M2(H) HJ28.AM2
PUN_FEED_SWITCH_: C01.U2 HJ28.AT2
SYNC_PUN: C01.F2 HJ28.AV2
Unconnected: C01.A2 C01.B2 C06.J2(D) C06.K2(E) C06.L2(F) C06.M2(H) C06.S2(R) HJ28.AJ1 HJ28.AJ2 HJ28.AS1 HJ28.AU2

### Notes on the sheet
- IOT 4
- IOT 2
- IOT 1
- D-BS-pp8i-0-1 High Speed Punch

## Sheet 36 of 40
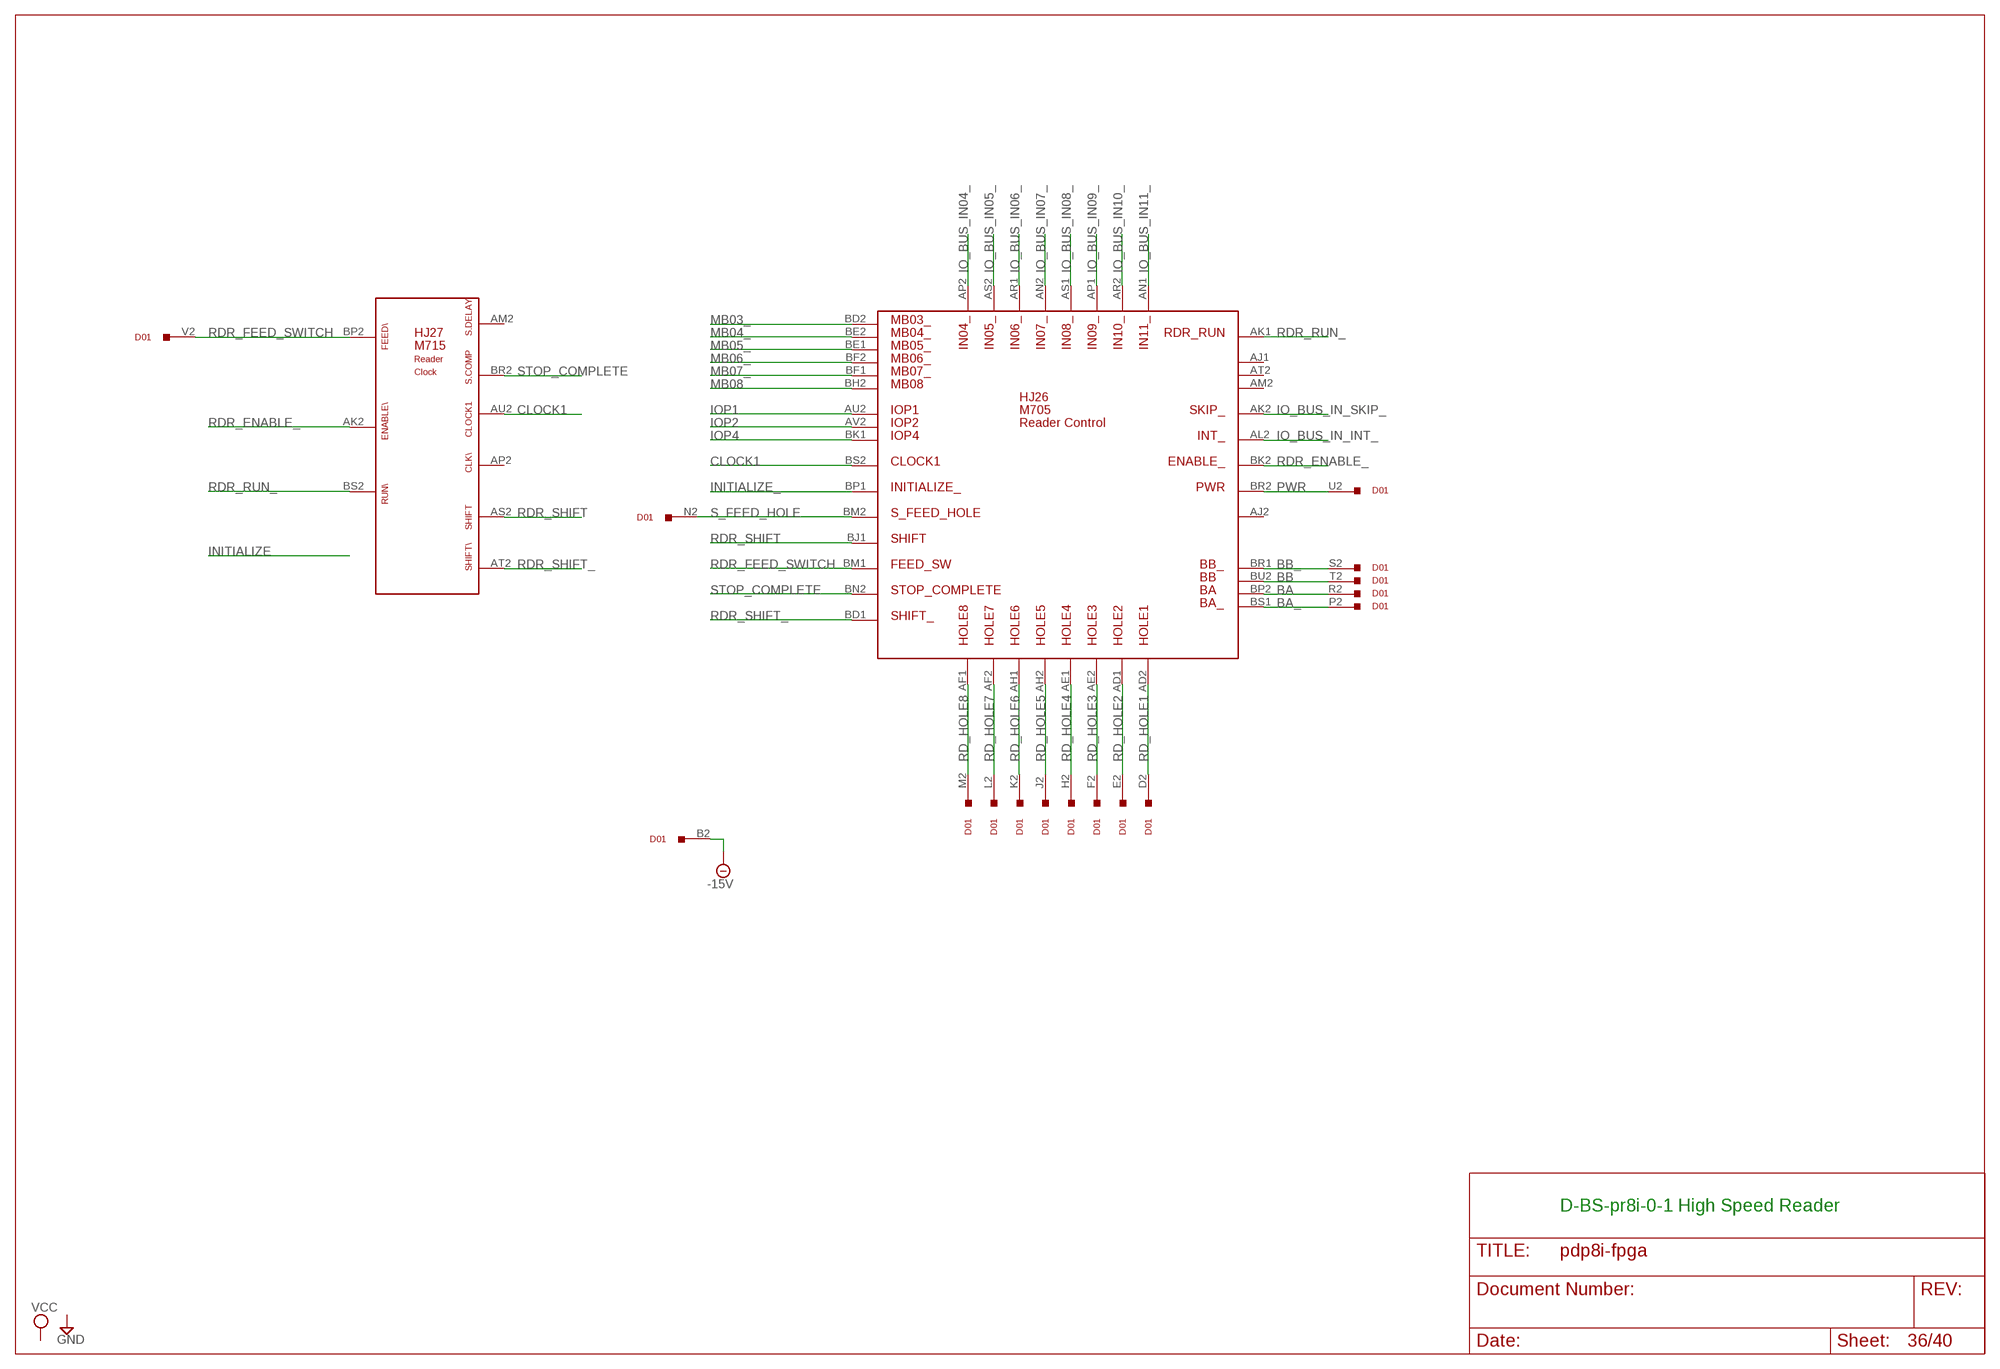
[diagram p36: schematic, sheet 36]

### Parts
D01  W077  W023  [H807]
HJ26  M705  [H807-2]
HJ27  M715  [H807-2]

### Nets
-15V [Suppply]: D01.B2 ; also sheet 33
BA: D01.R2 HJ26.BP2
BA_: D01.P2 HJ26.BS1
BB: D01.T2 HJ26.BU2
BB_: D01.S2 HJ26.BR1
CLOCK1: HJ26.BS2 HJ27.AU2(AU)
INITIALIZE_: HJ26.BP1 ; also sheet 2,14,26,30,32,35,37,38,39
IO_BUS_IN04_: HJ26.AP2 ; also sheet 14,37,39
IO_BUS_IN05_: HJ26.AS2 ; also sheet 14,37,39
IO_BUS_IN06_: HJ26.AR1 ; also sheet 14,37,39
IO_BUS_IN07_: HJ26.AN2 ; also sheet 14,37,39
IO_BUS_IN08_: HJ26.AS1 ; also sheet 14,37,39
IO_BUS_IN09_: HJ26.AP1 ; also sheet 14,37,39
IO_BUS_IN10_: HJ26.AR2 ; also sheet 14,37,39
IO_BUS_IN11_: HJ26.AN1 ; also sheet 14,37,39
IO_BUS_IN_INT_: HJ26.AL2 ; also sheet 14,33,34,35,37,38
IO_BUS_IN_SKIP_: HJ26.AK2 ; also sheet 14,33,34,35,37,38
IOP1: HJ26.AU2 ; also sheet 2,15,16,30,33,34,35
IOP2: HJ26.AV2 ; also sheet 2,15,16,32,33,34,35
IOP4: HJ26.BK1 ; also sheet 2,15,16,30,33,34,35
MB03_: HJ26.BD2 ; also sheet 4,5,6,7,8,9,14,15,16,22,30,32,33,35,37
MB04_: HJ26.BE2 ; also sheet 5,8,9,14,15,16,27,29,30,32,33,34,35,37
MB05_: HJ26.BE1 ; also sheet 5,8,9,14,15,16,22,29,30,33,35,38
MB06_: HJ26.BF2 ; also sheet 5,8,9,14,15,22,29,30,32,34,35,37,38
MB07_: HJ26.BF1 ; also sheet 5,8,9,14,16,22,26,28,29,30,32,33,34
MB08: HJ26.BH2 ; also sheet 6,7,9,14,15,21,22,26,27,30,33,34,37,38
PWR: D01.U2 HJ26.BR2
RD_HOLE1: D01.D2 HJ26.AD2
RD_HOLE2: D01.E2 HJ26.AD1
RD_HOLE3: D01.F2 HJ26.AE2
RD_HOLE4: D01.H2 HJ26.AE1
RD_HOLE5: D01.J2 HJ26.AH2
RD_HOLE6: D01.K2 HJ26.AH1
RD_HOLE7: D01.L2 HJ26.AF2
RD_HOLE8: D01.M2 HJ26.AF1
RDR_ENABLE_: HJ26.BK2 HJ27.AK2(AK)
RDR_FEED_SWITCH: D01.V2 HJ26.BM1 HJ27.BP2(BP)
RDR_RUN_: HJ26.AK1 HJ27.BS2(BS)
RDR_SHIFT: HJ26.BJ1 HJ27.AS2(AS)
RDR_SHIFT_: HJ26.BD1 HJ27.AT2(AT)
S_FEED_HOLE: D01.N2 HJ26.BM2
STOP_COMPLETE: HJ26.BN2 HJ27.BR2(BR)
Unconnected: D01.A2 D01.C2 HJ26.AJ1 HJ26.AJ2 HJ26.AM2 HJ26.AT2 HJ27.AM2(AM) HJ27.AP2(AP)

### Notes on the sheet
- D-BS-pr8i-0-1 High Speed Reader

## Sheet 37 of 40
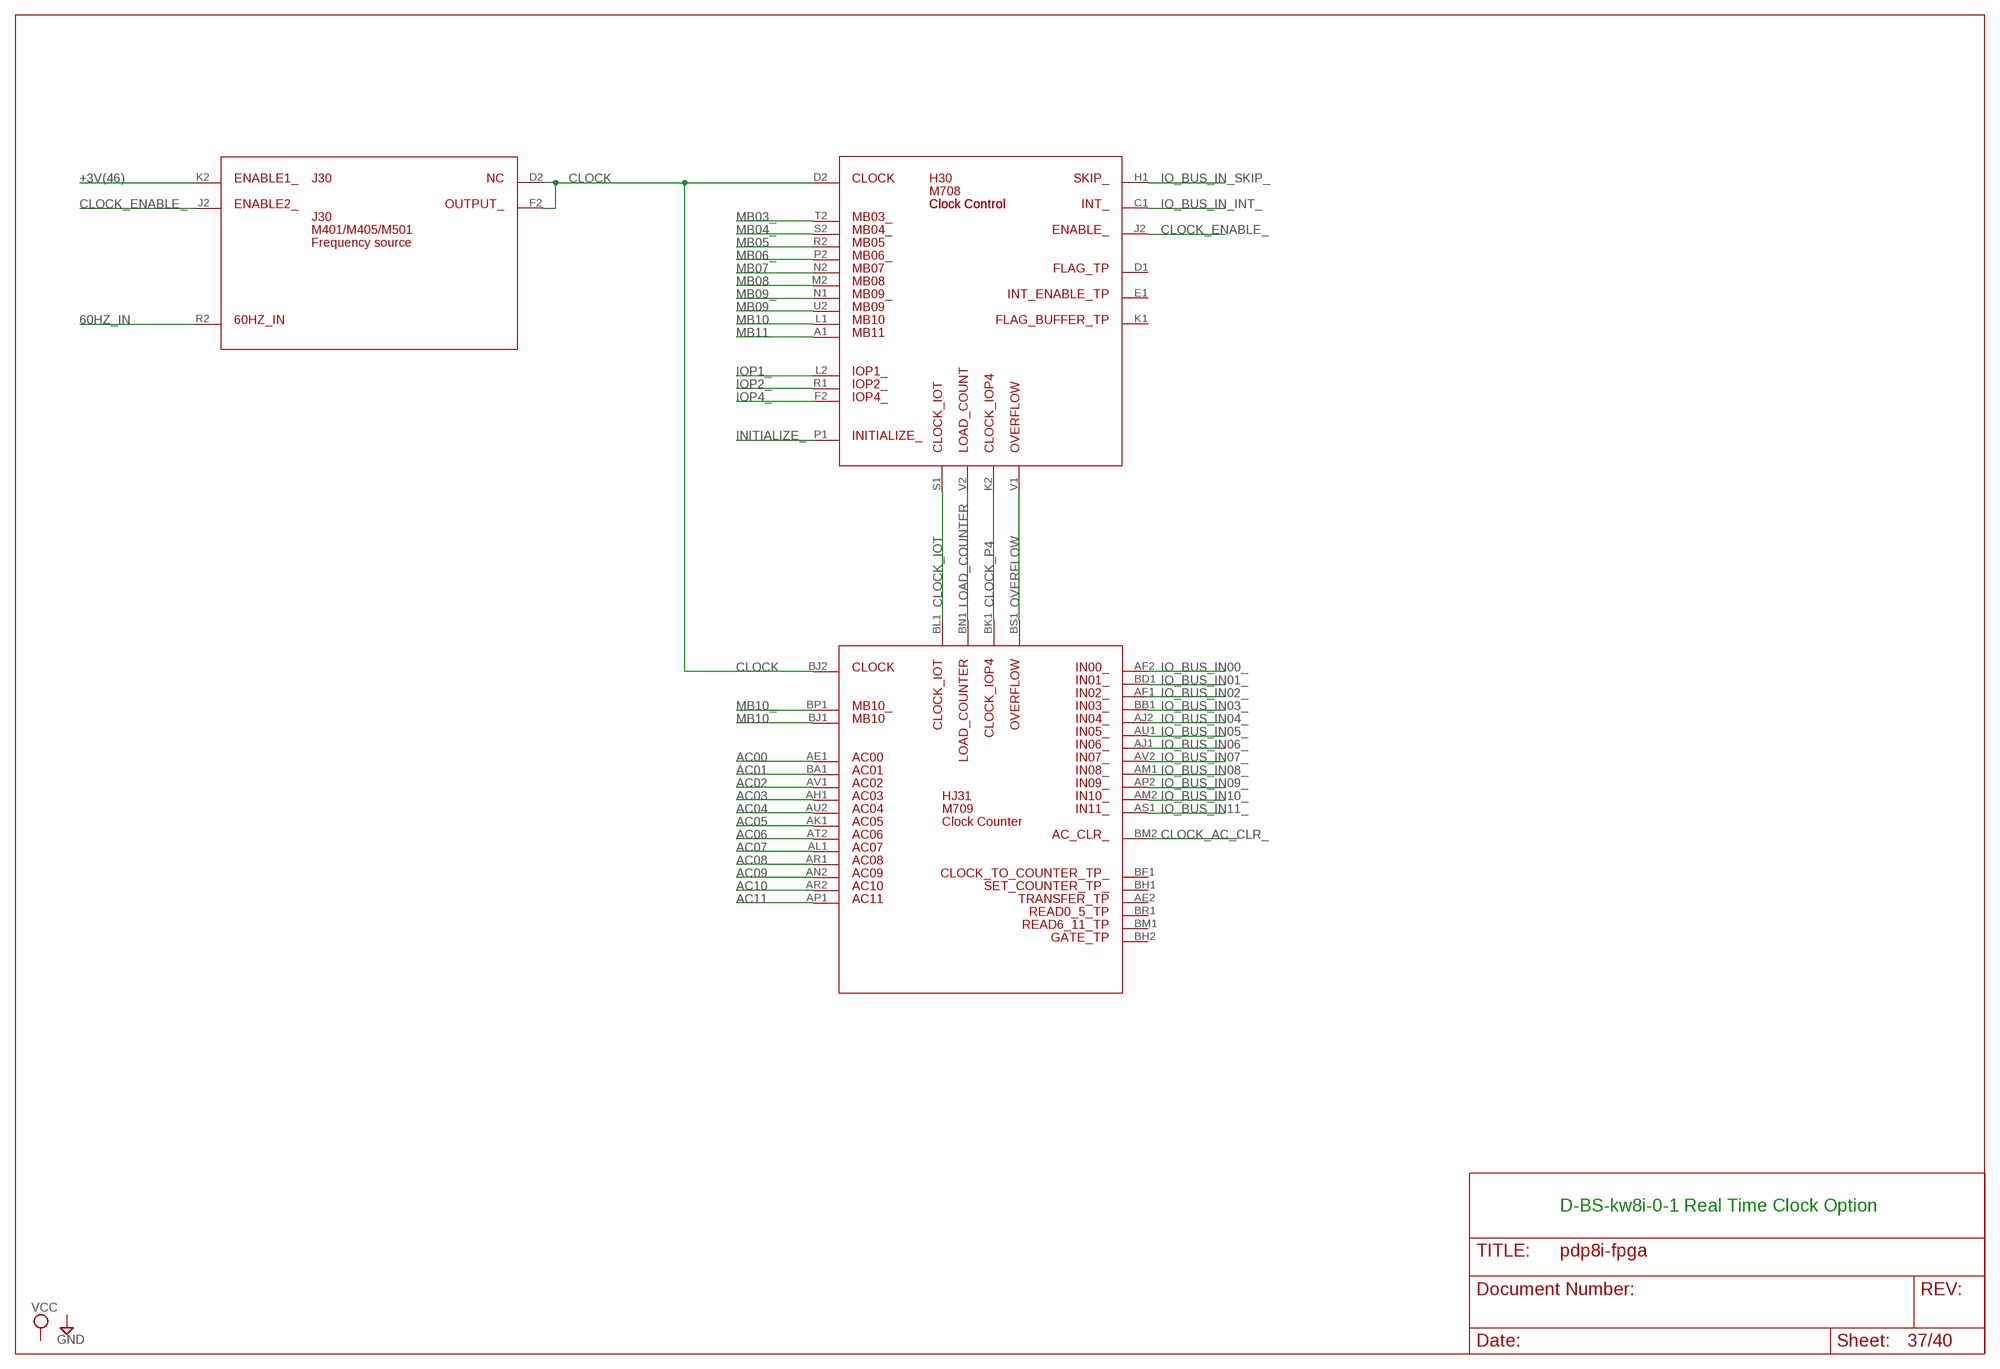
[diagram p37: schematic, sheet 37]

### Parts
H30  M708  [H807]
HJ31  M709  [H807-2]
J30  M401/M405/M501  M501  [H807]

### Nets
60HZ_IN: J30.R2
+3V(46): J30.K2 ; also sheet 1,2,5
AC00: HJ31.AE1 ; also sheet 7,9,14,27,28
AC01: HJ31.BA1 ; also sheet 9,14,27,28
AC02: HJ31.AV1 ; also sheet 9,14,27,28,33
AC03: HJ31.AH1 ; also sheet 9,14,28,33
AC04: HJ31.AU2 ; also sheet 9,14,16,28,33,35
AC05: HJ31.AK1 ; also sheet 9,14,16,28,33,35
AC06: HJ31.AT2 ; also sheet 9,14,16,28,33,35
AC07: HJ31.AL1 ; also sheet 9,14,16,28,33,35
AC08: HJ31.AR1 ; also sheet 9,14,16,28,33,35
AC09: HJ31.AN2 ; also sheet 9,14,16,28,33,35
AC10: HJ31.AR2 ; also sheet 9,14,16,28,33,35
AC11: HJ31.AP1 ; also sheet 9,14,16,28,33,35
CLOCK: H30.D2 HJ31.BJ2 J30.D2 J30.F2
CLOCK_AC_CLR_: HJ31.BM2 ; also sheet 14
CLOCK_ENABLE_: H30.J2 J30.J2
CLOCK_IOT: H30.S1 HJ31.BL1
CLOCK_P4: H30.K2 HJ31.BK1
INITIALIZE_: H30.P1 ; also sheet 2,14,26,30,32,35,36,38,39
IO_BUS_IN00_: HJ31.AF2 ; also sheet 14,39
IO_BUS_IN01_: HJ31.BD1 ; also sheet 14,39
IO_BUS_IN02_: HJ31.AF1 ; also sheet 14,39
IO_BUS_IN03_: HJ31.BB1 ; also sheet 14,39
IO_BUS_IN04_: HJ31.AJ2 ; also sheet 14,36,39
IO_BUS_IN05_: HJ31.AU1 ; also sheet 14,36,39
IO_BUS_IN06_: HJ31.AJ1 ; also sheet 14,36,39
IO_BUS_IN07_: HJ31.AV2 ; also sheet 14,36,39
IO_BUS_IN08_: HJ31.AM1 ; also sheet 14,36,39
IO_BUS_IN09_: HJ31.AP2 ; also sheet 14,36,39
IO_BUS_IN10_: HJ31.AM2 ; also sheet 14,36,39
IO_BUS_IN11_: HJ31.AS1 ; also sheet 14,36,39
IO_BUS_IN_INT_: H30.C1 ; also sheet 14,33,34,35,36,38
IO_BUS_IN_SKIP_: H30.H1 ; also sheet 14,33,34,35,36,38
IOP1_: H30.L2 ; also sheet 2,5,14,34
IOP2_: H30.R1 ; also sheet 2,5,14,34
IOP4_: H30.F2 ; also sheet 2,5,14
LOAD_COUNTER: H30.V2 HJ31.BN1
MB03_: H30.T2 ; also sheet 4,5,6,7,8,9,14,15,16,22,30,32,33,35,36
MB04_: H30.S2 ; also sheet 5,8,9,14,15,16,27,29,30,32,33,34,35,36
MB05: H30.R2 ; also sheet 5,7,9,14,21,27,30,32,34
MB06_: H30.P2 ; also sheet 5,8,9,14,15,22,29,30,32,34,35,36,38
MB07: H30.N2 ; also sheet 5,7,9,14,15,21,22,26,27,30,33,34,35,38
MB08: H30.M2 ; also sheet 6,7,9,14,15,21,22,26,27,30,33,34,36,38
MB09: H30.U2 ; also sheet 2,5,6,9,14,21,22,27,29,30
MB09_: H30.N1 ; also sheet 6,9,26,27,28,30,33
MB10: H30.L1 HJ31.BJ1 ; also sheet 2,6,8,9,14,21,22,27,29,30,33
MB10_: HJ31.BP1 ; also sheet 6,8,9,22,26,27,28,30
MB11: H30.A1 ; also sheet 2,6,9,14,21,22,27,29,30,33
OVERFLOW: H30.V1 HJ31.BS1
Unconnected: H30.D1 H30.E1 H30.K1 HJ31.AE2 HJ31.BF1 HJ31.BH1 HJ31.BH2 HJ31.BM1 HJ31.BR1

### Notes on the sheet
- J30
- Clock Control
- D-BS-kw8i-0-1 Real Time Clock Option

## Sheet 38 of 40
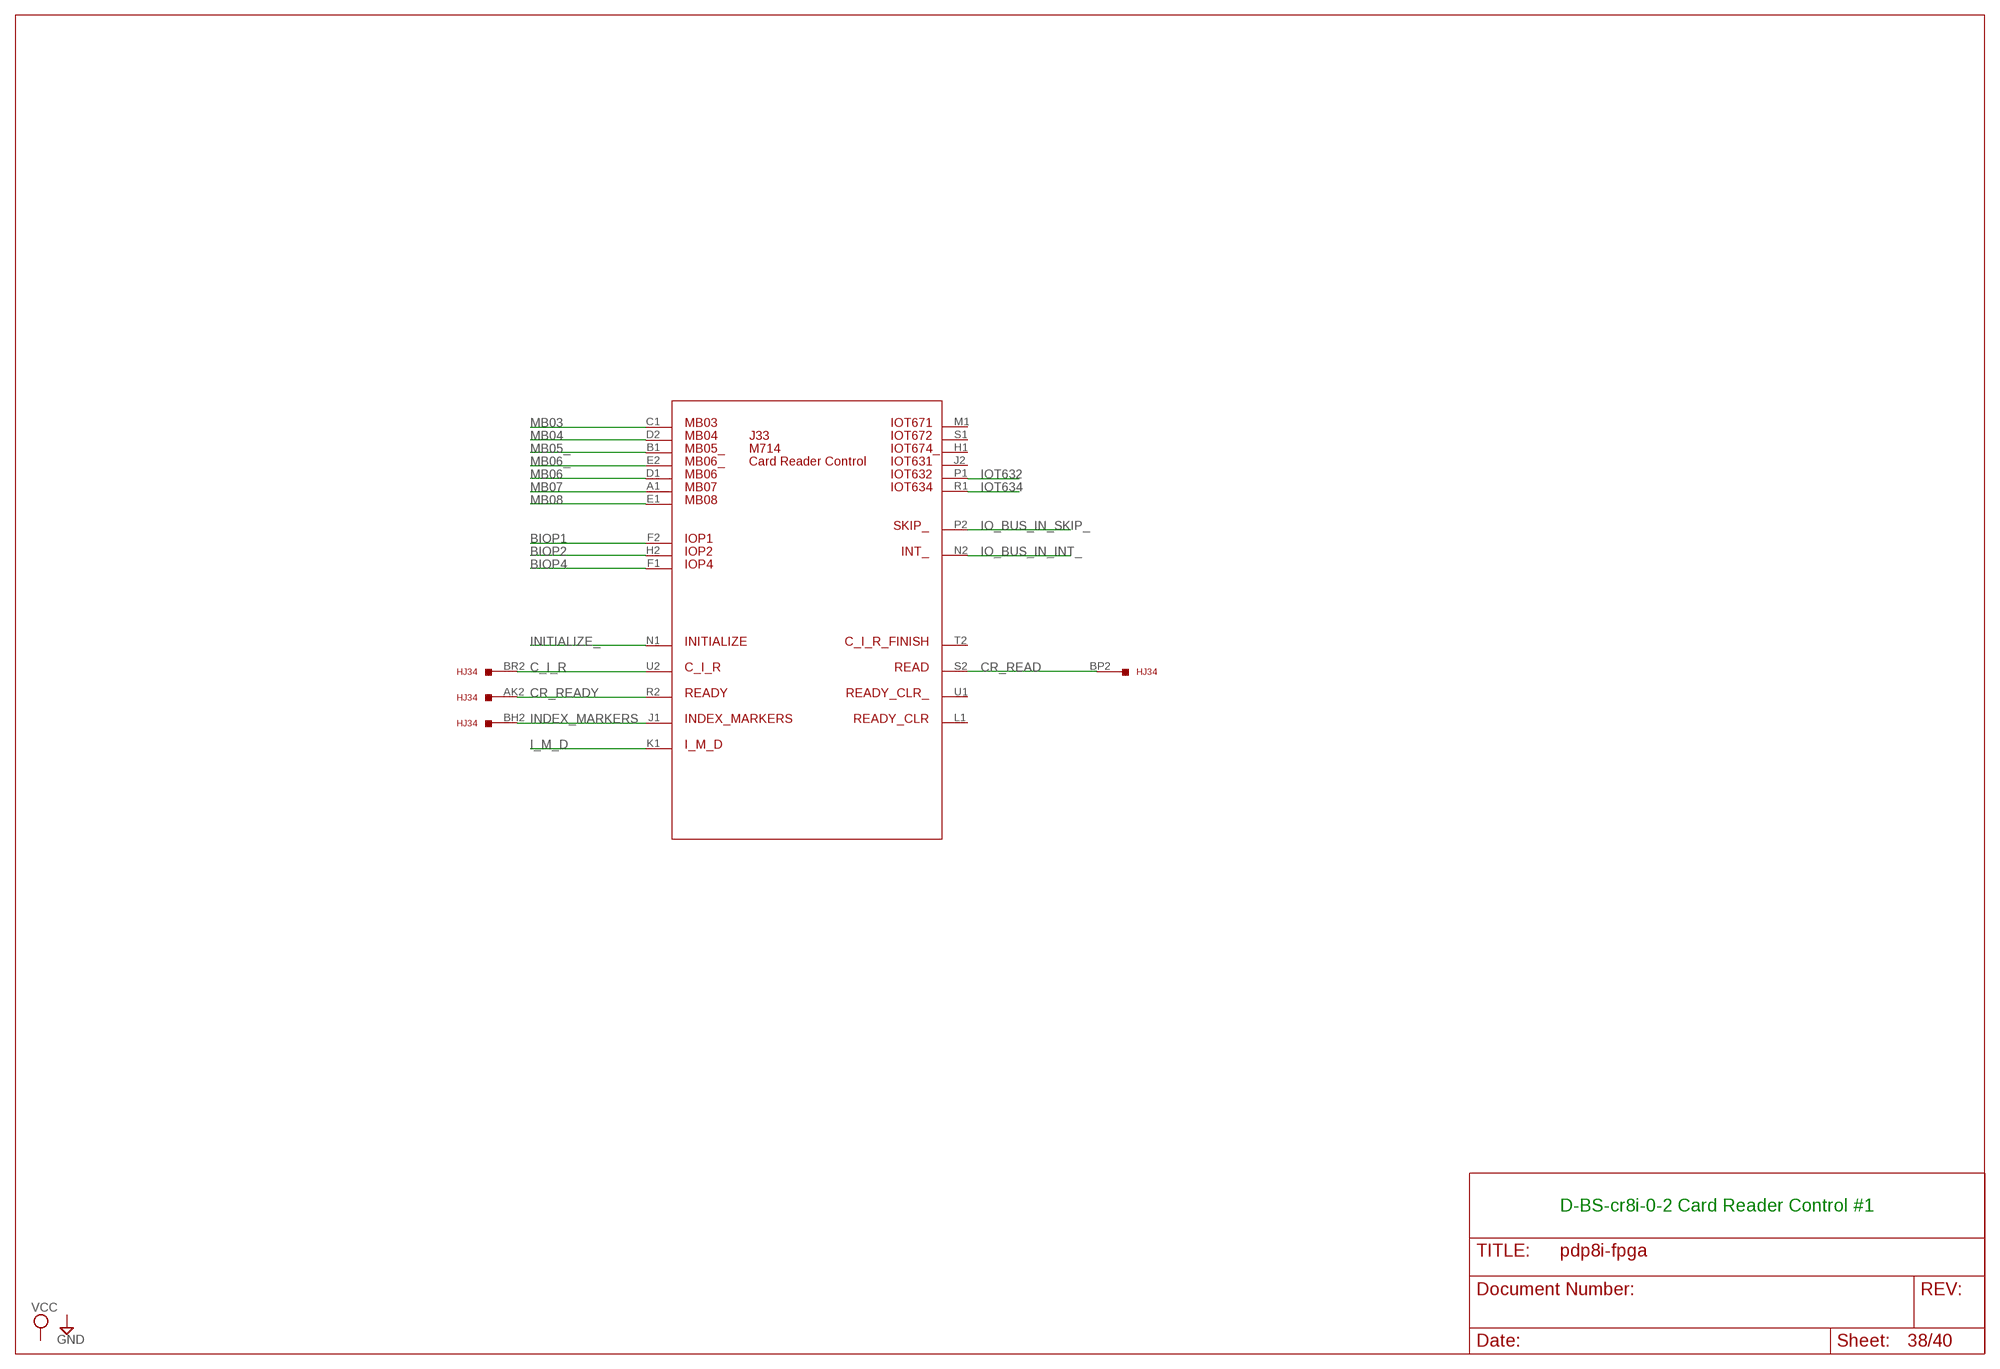
[diagram p38: schematic, sheet 38]

### Parts
HJ34  W991  [H807-2]
J33  M714  [H807]

### Nets
BIOP1: J33.F2 ; also sheet 2
BIOP2: J33.H2 ; also sheet 2
BIOP4: J33.F1 ; also sheet 2
C_I_R: HJ34.BR2 J33.U2
CR_READ: HJ34.BP2 J33.S2
CR_READY: HJ34.AK2 J33.R2
I_M_D: J33.K1 ; also sheet 39
INDEX_MARKERS: HJ34.BH2 J33.J1 ; also sheet 39
INITIALIZE_: J33.N1 ; also sheet 2,14,26,30,32,35,36,37,39
IO_BUS_IN_INT_: J33.N2 ; also sheet 14,33,34,35,36,37
IO_BUS_IN_SKIP_: J33.P2 ; also sheet 14,33,34,35,36,37
IOT632: J33.P1 ; also sheet 39
IOT634: J33.R1 ; also sheet 39
MB03: J33.C1 ; also sheet 4,5,9,14,21,27,29,30,34
MB04: J33.D2 ; also sheet 5,9,14,21,22,30
MB05_: J33.B1 ; also sheet 5,8,9,14,15,16,22,29,30,33,35,36
MB06: J33.D1 ; also sheet 5,7,9,14,16,21,22,27,30,33
MB06_: J33.E2 ; also sheet 5,8,9,14,15,22,29,30,32,34,35,36,37
MB07: J33.A1 ; also sheet 5,7,9,14,15,21,22,26,27,30,33,34,35,37
MB08: J33.E1 ; also sheet 6,7,9,14,15,21,22,26,27,30,33,34,36,37
Unconnected: HJ34.AA2 HJ34.AB2 HJ34.AD2 HJ34.AE2 HJ34.AF2 HJ34.AH2 HJ34.AJ2 HJ34.AL2 HJ34.AM2 HJ34.AN2 HJ34.AP2 HJ34.AR2 HJ34.AS2 HJ34.AT2 HJ34.AU2 HJ34.AV2 HJ34.BA2 HJ34.BB2 J33.H1 J33.J2 J33.L1 J33.M1 J33.S1 J33.T2 J33.U1

### Notes on the sheet
- D-BS-cr8i-0-2 Card Reader Control #1

## Sheet 39 of 40
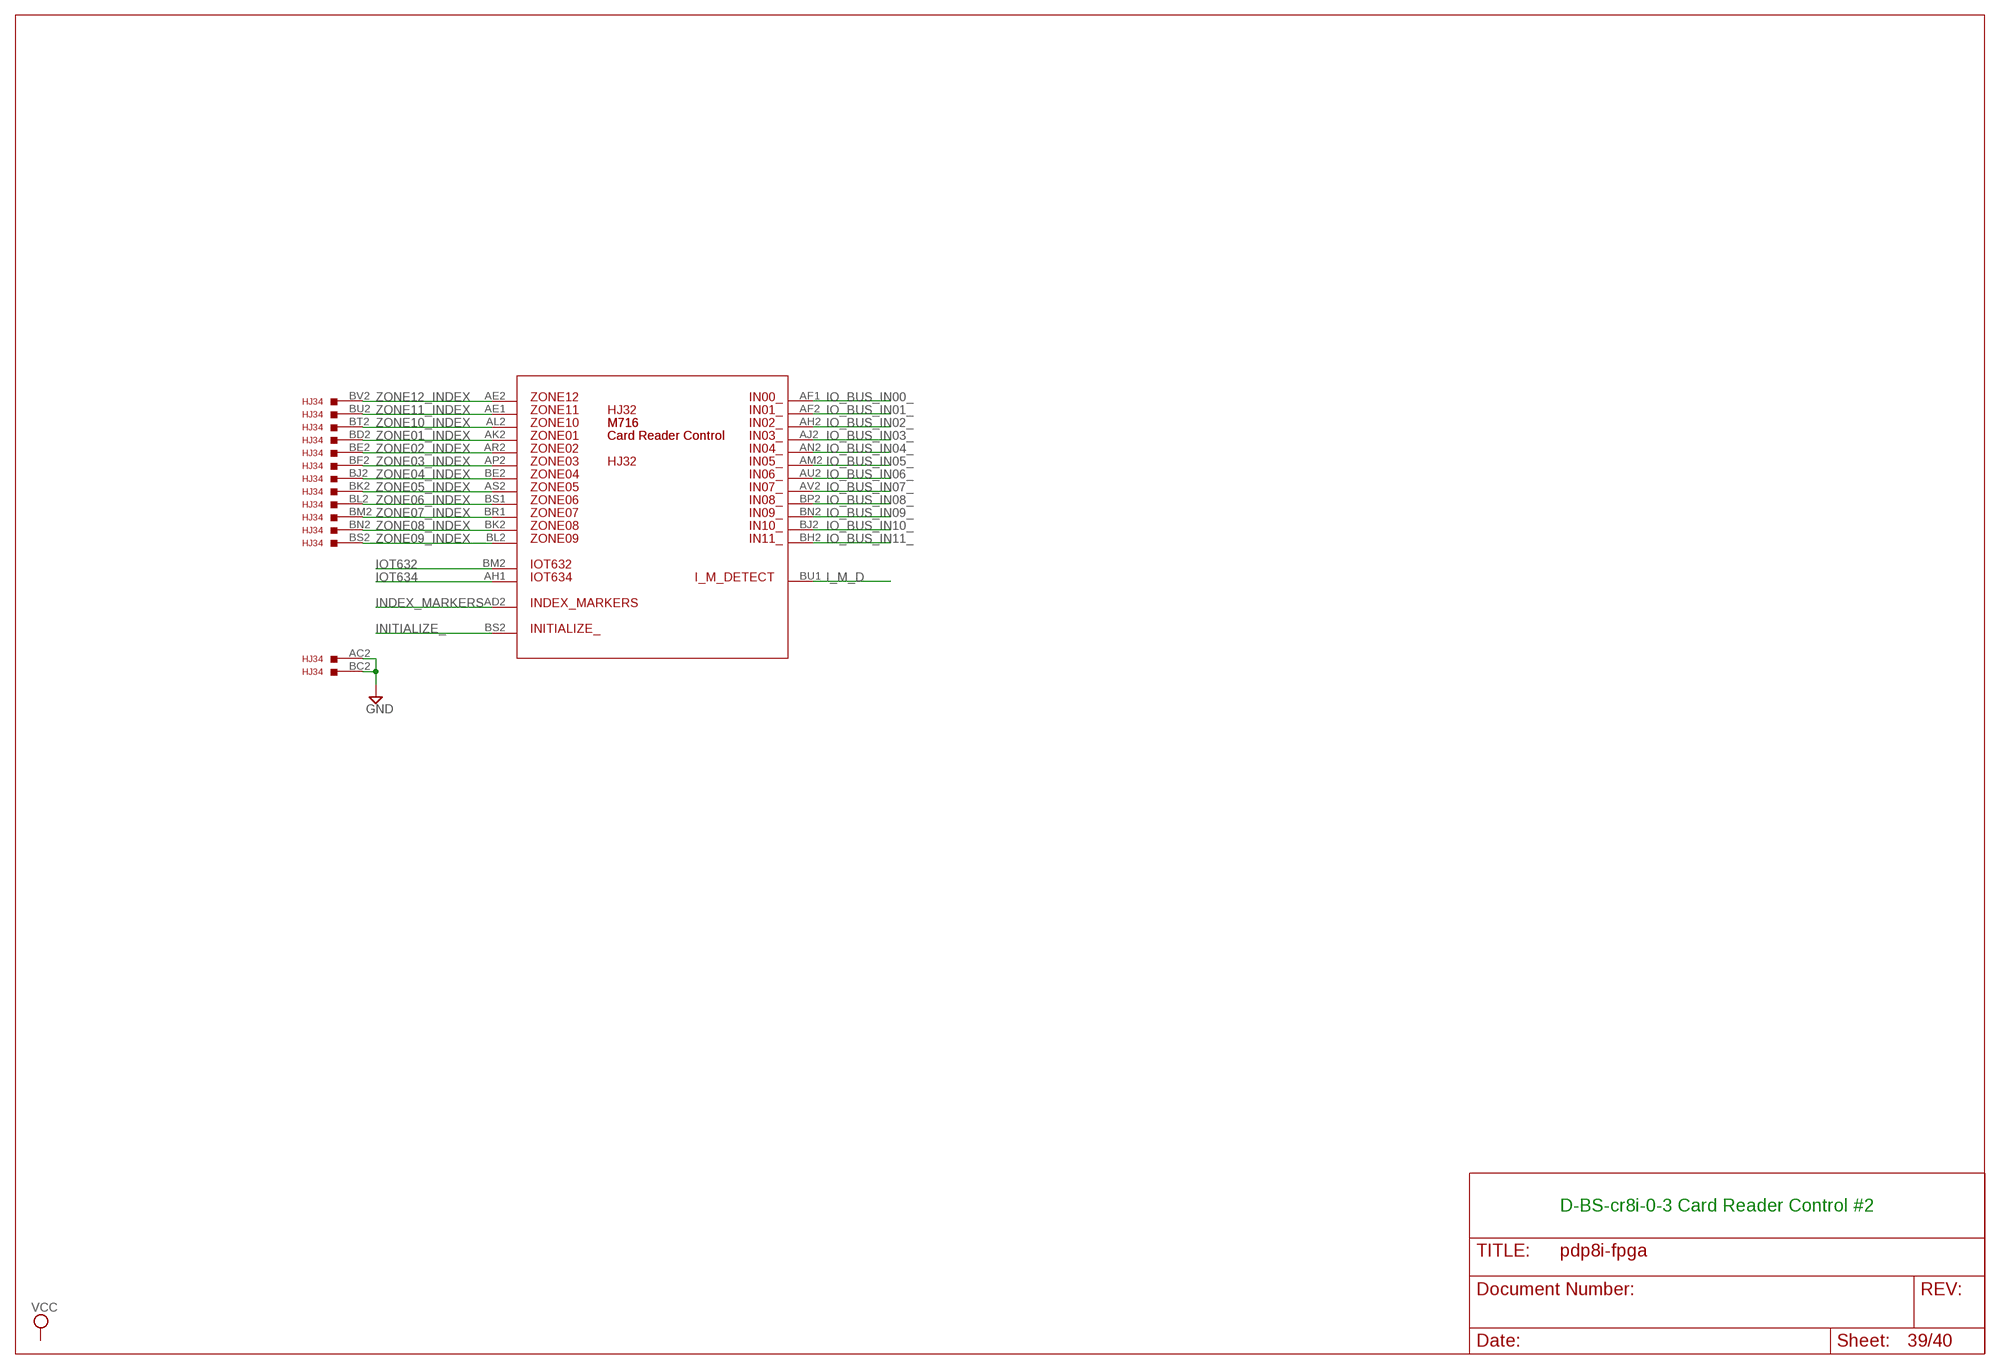
[diagram p39: schematic, sheet 39]

### Parts
HJ32  M716  [H807-2]

### Nets
GND [Suppply]: HJ34.AC2 HJ34.BC2 ; also sheet 2,5,9,10,11,12,13,14,15,22,26,27,30,33,34,35
I_M_D: HJ32.BU1 ; also sheet 38
INDEX_MARKERS: HJ32.AD2 ; also sheet 38
INITIALIZE_: HJ32.BS2 ; also sheet 2,14,26,30,32,35,36,37,38
IO_BUS_IN00_: HJ32.AF1 ; also sheet 14,37
IO_BUS_IN01_: HJ32.AF2 ; also sheet 14,37
IO_BUS_IN02_: HJ32.AH2 ; also sheet 14,37
IO_BUS_IN03_: HJ32.AJ2 ; also sheet 14,37
IO_BUS_IN04_: HJ32.AN2 ; also sheet 14,36,37
IO_BUS_IN05_: HJ32.AM2 ; also sheet 14,36,37
IO_BUS_IN06_: HJ32.AU2 ; also sheet 14,36,37
IO_BUS_IN07_: HJ32.AV2 ; also sheet 14,36,37
IO_BUS_IN08_: HJ32.BP2 ; also sheet 14,36,37
IO_BUS_IN09_: HJ32.BN2 ; also sheet 14,36,37
IO_BUS_IN10_: HJ32.BJ2 ; also sheet 14,36,37
IO_BUS_IN11_: HJ32.BH2 ; also sheet 14,36,37
IOT632: HJ32.BM2 ; also sheet 38
IOT634: HJ32.AH1 ; also sheet 38
ZONE01_INDEX: HJ32.AK2 HJ34.BD2
ZONE02_INDEX: HJ32.AR2 HJ34.BE2
ZONE03_INDEX: HJ32.AP2 HJ34.BF2
ZONE04_INDEX: HJ32.BE2 HJ34.BJ2
ZONE05_INDEX: HJ32.AS2 HJ34.BK2
ZONE06_INDEX: HJ32.BS1 HJ34.BL2
ZONE07_INDEX: HJ32.BR1 HJ34.BM2
ZONE08_INDEX: HJ32.BK2 HJ34.BN2
ZONE09_INDEX: HJ32.BL2 HJ34.BS2
ZONE10_INDEX: HJ32.AL2 HJ34.BT2
ZONE11_INDEX: HJ32.AE1 HJ34.BU2
ZONE12_INDEX: HJ32.AE2 HJ34.BV2

### Notes on the sheet
- M716
- Card Reader Control
- HJ32
- D-BS-cr8i-0-3 Card Reader Control #2

## Sheet 40 of 40
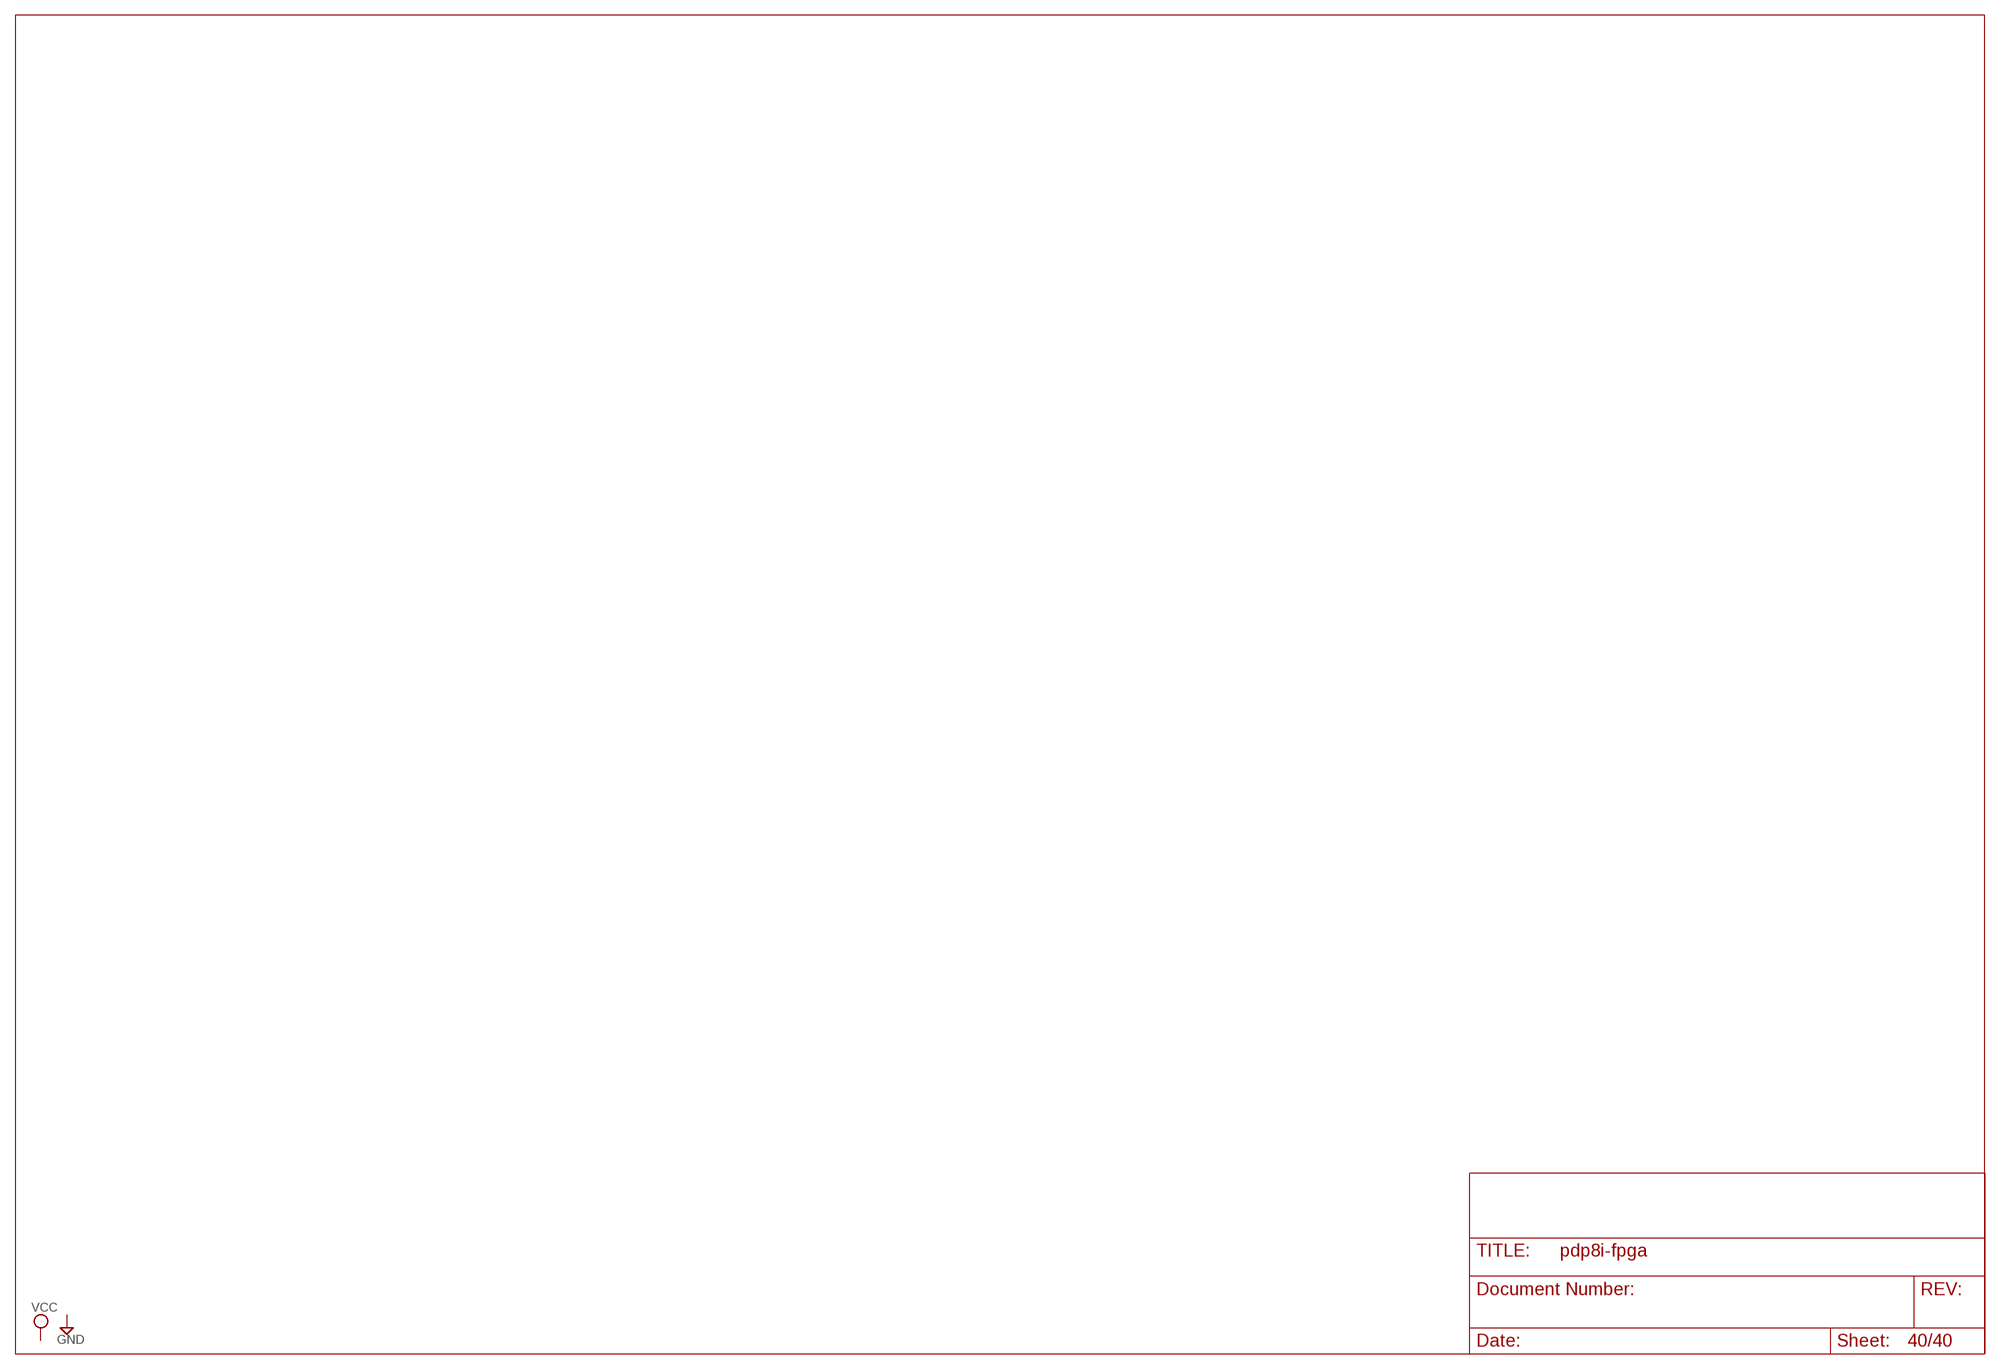
[diagram p40: schematic, sheet 40]